# EasyEDA Pro project 遥控关灯发射(物联网+433).eprj

# Schematic Schematic1

## Sheets
1 stm32: Create Date: 2022-12-05; Page Name: stm32; Project Name: 遥控关灯发射(物联网+433); Schematic Name: Schematic1; Update Date: 2022-12-05; Company: 嘉立创EDA; Page Size: A4; Version: V1.0
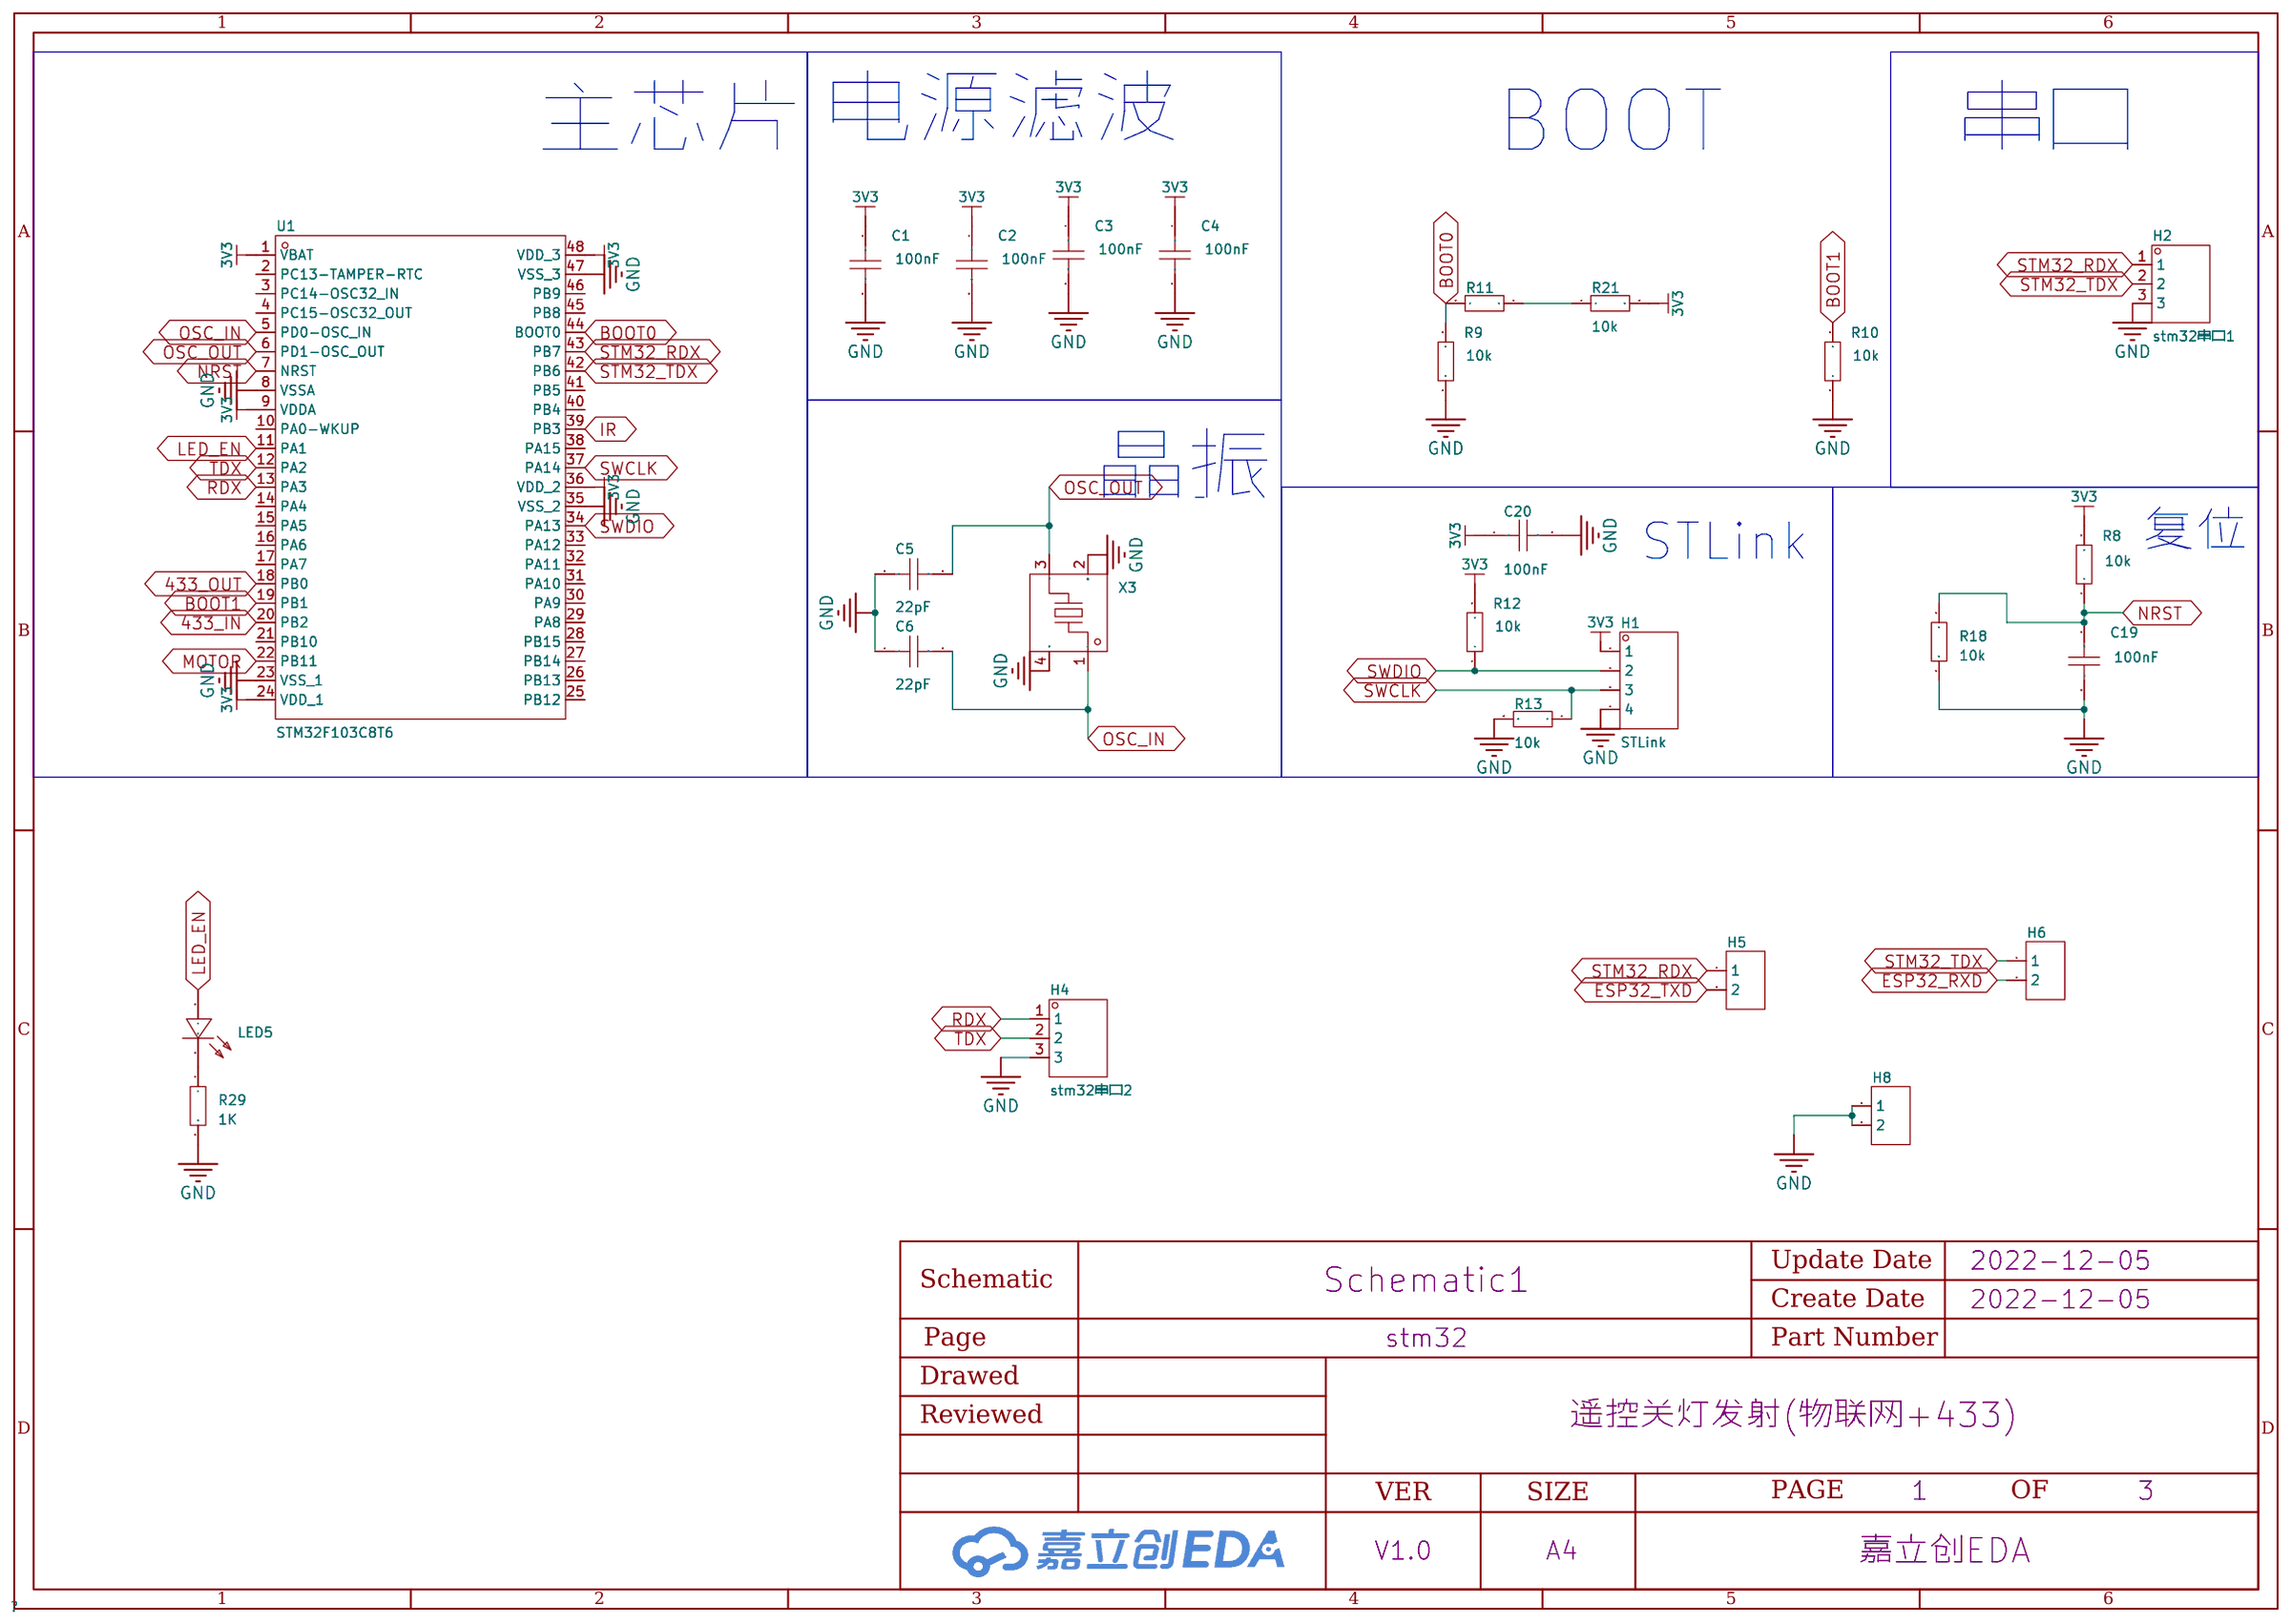
[diagram p0: stm32]
2 esp32: Page Name: esp32; Update Date: 2022-12-10
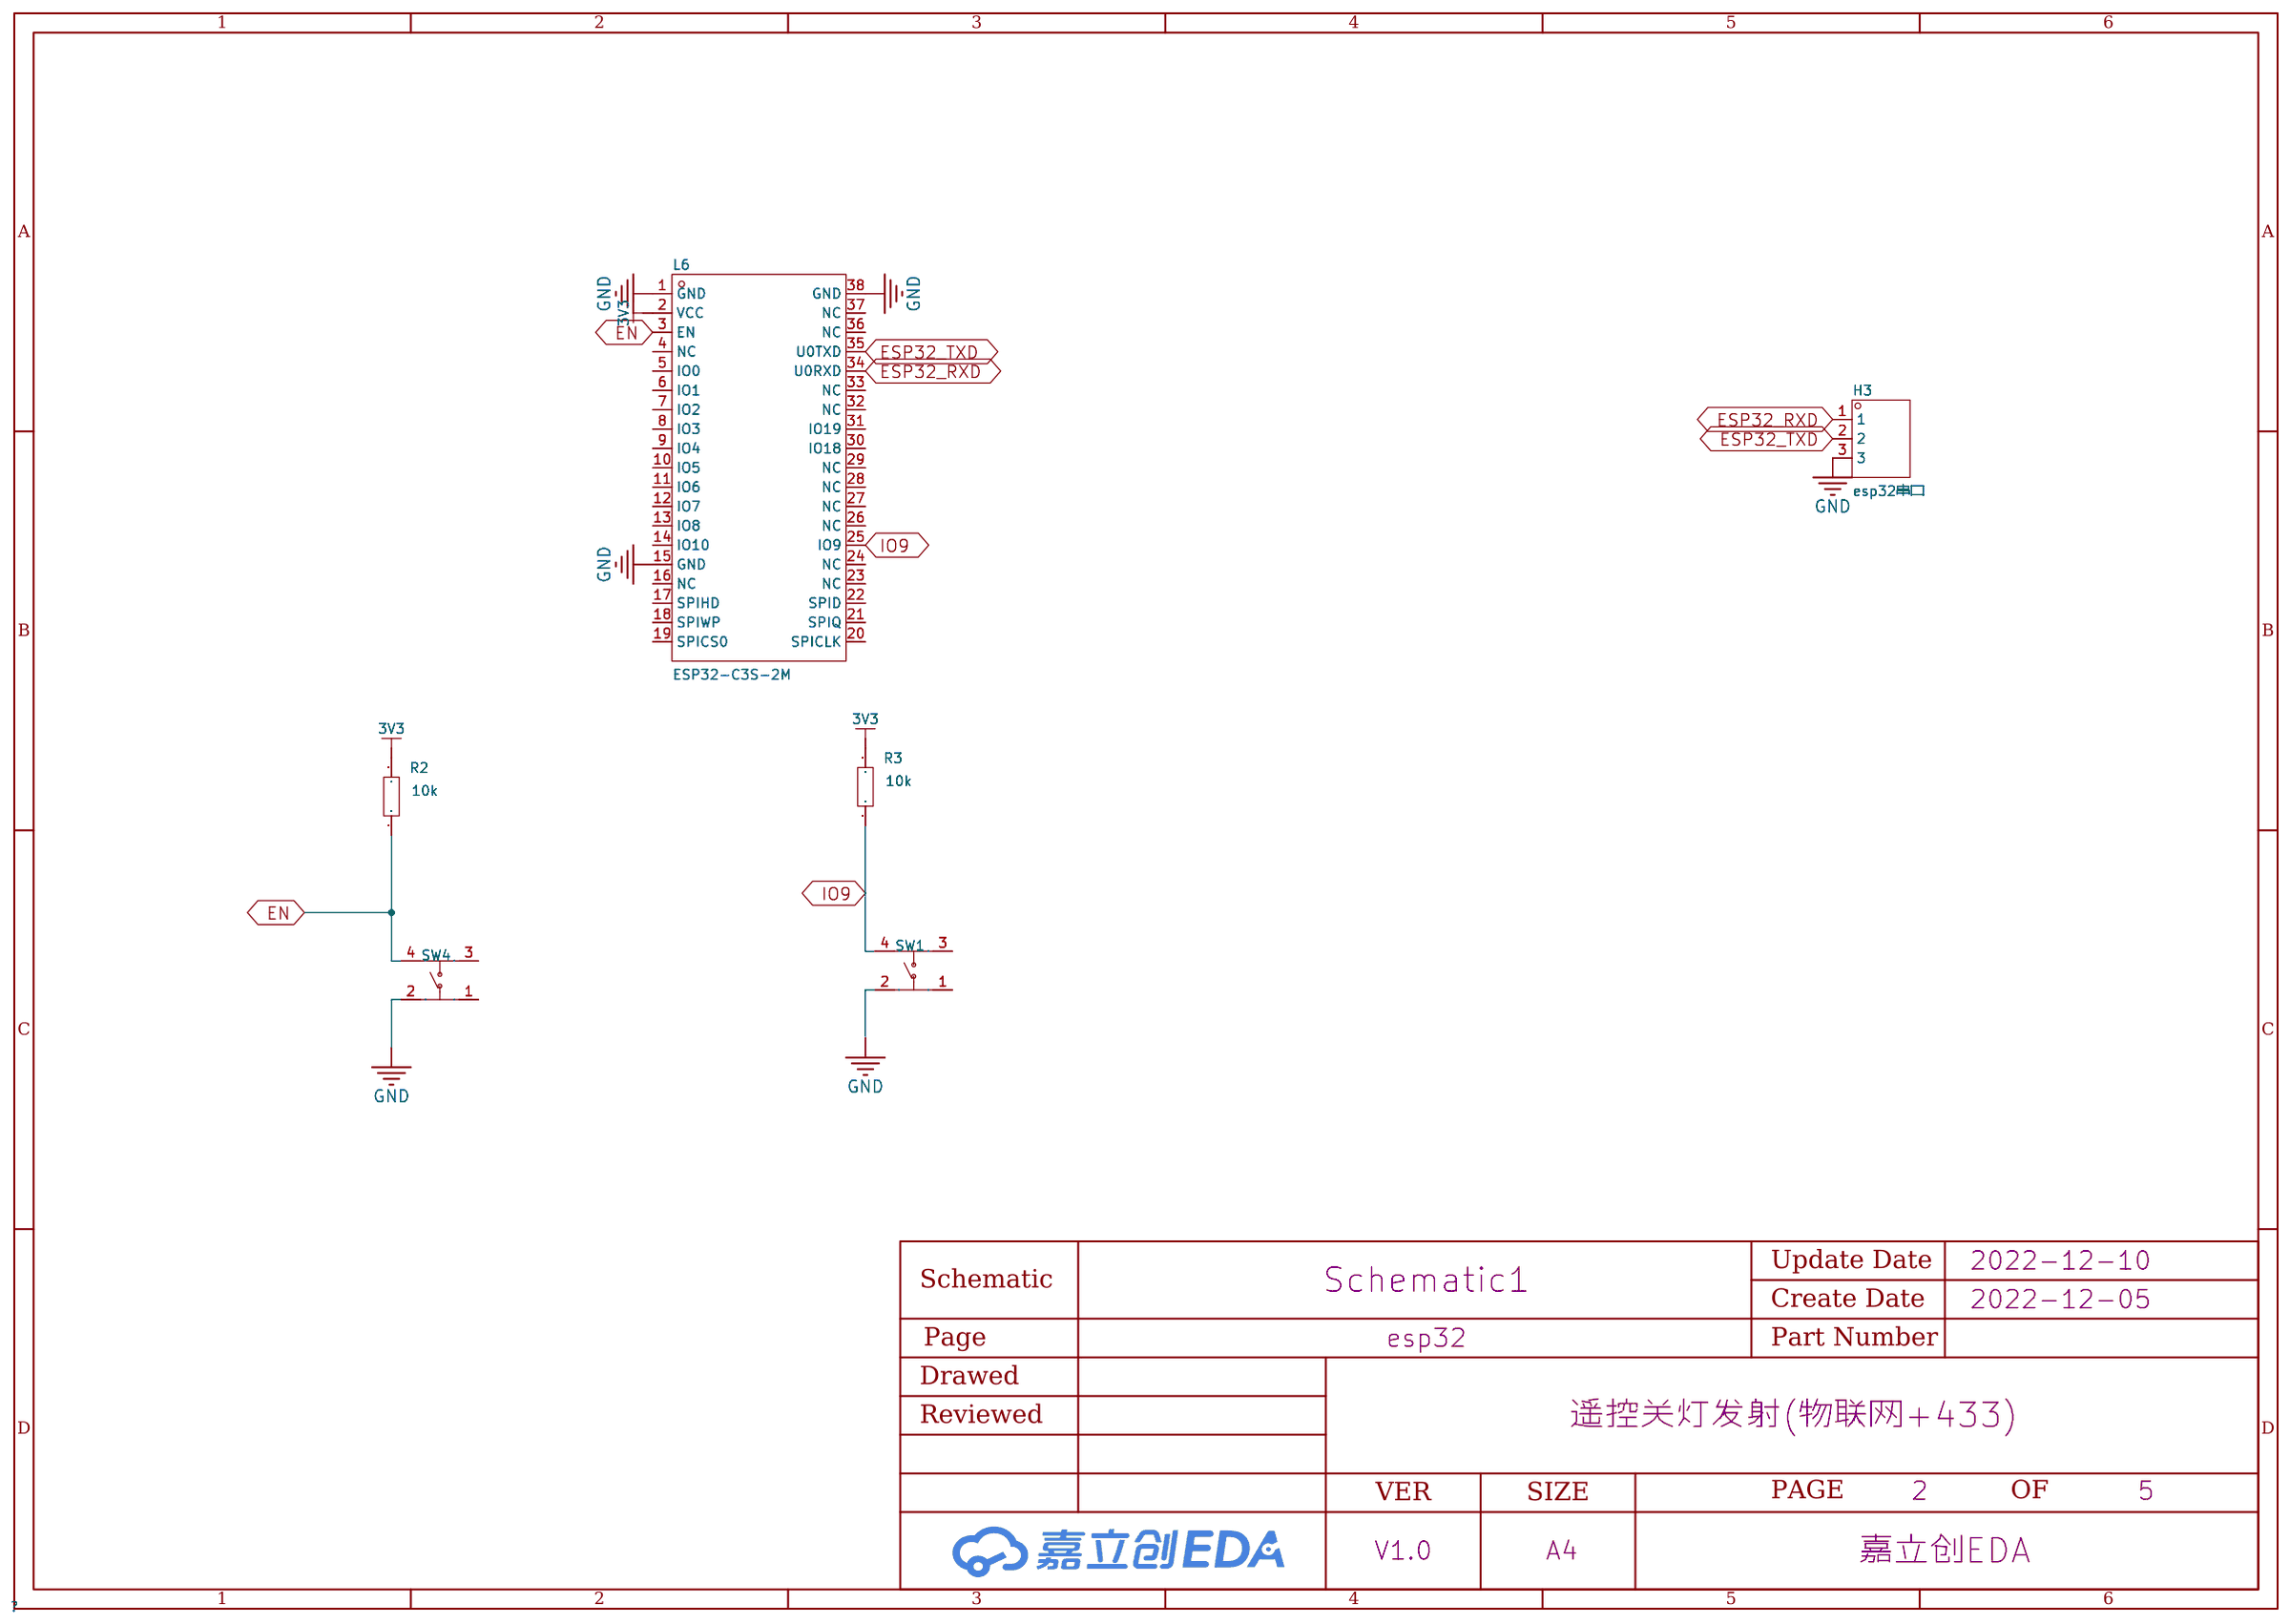
[diagram p1: esp32]
3 433发射: Page Name: 433发射; Update Date: 2022-12-17
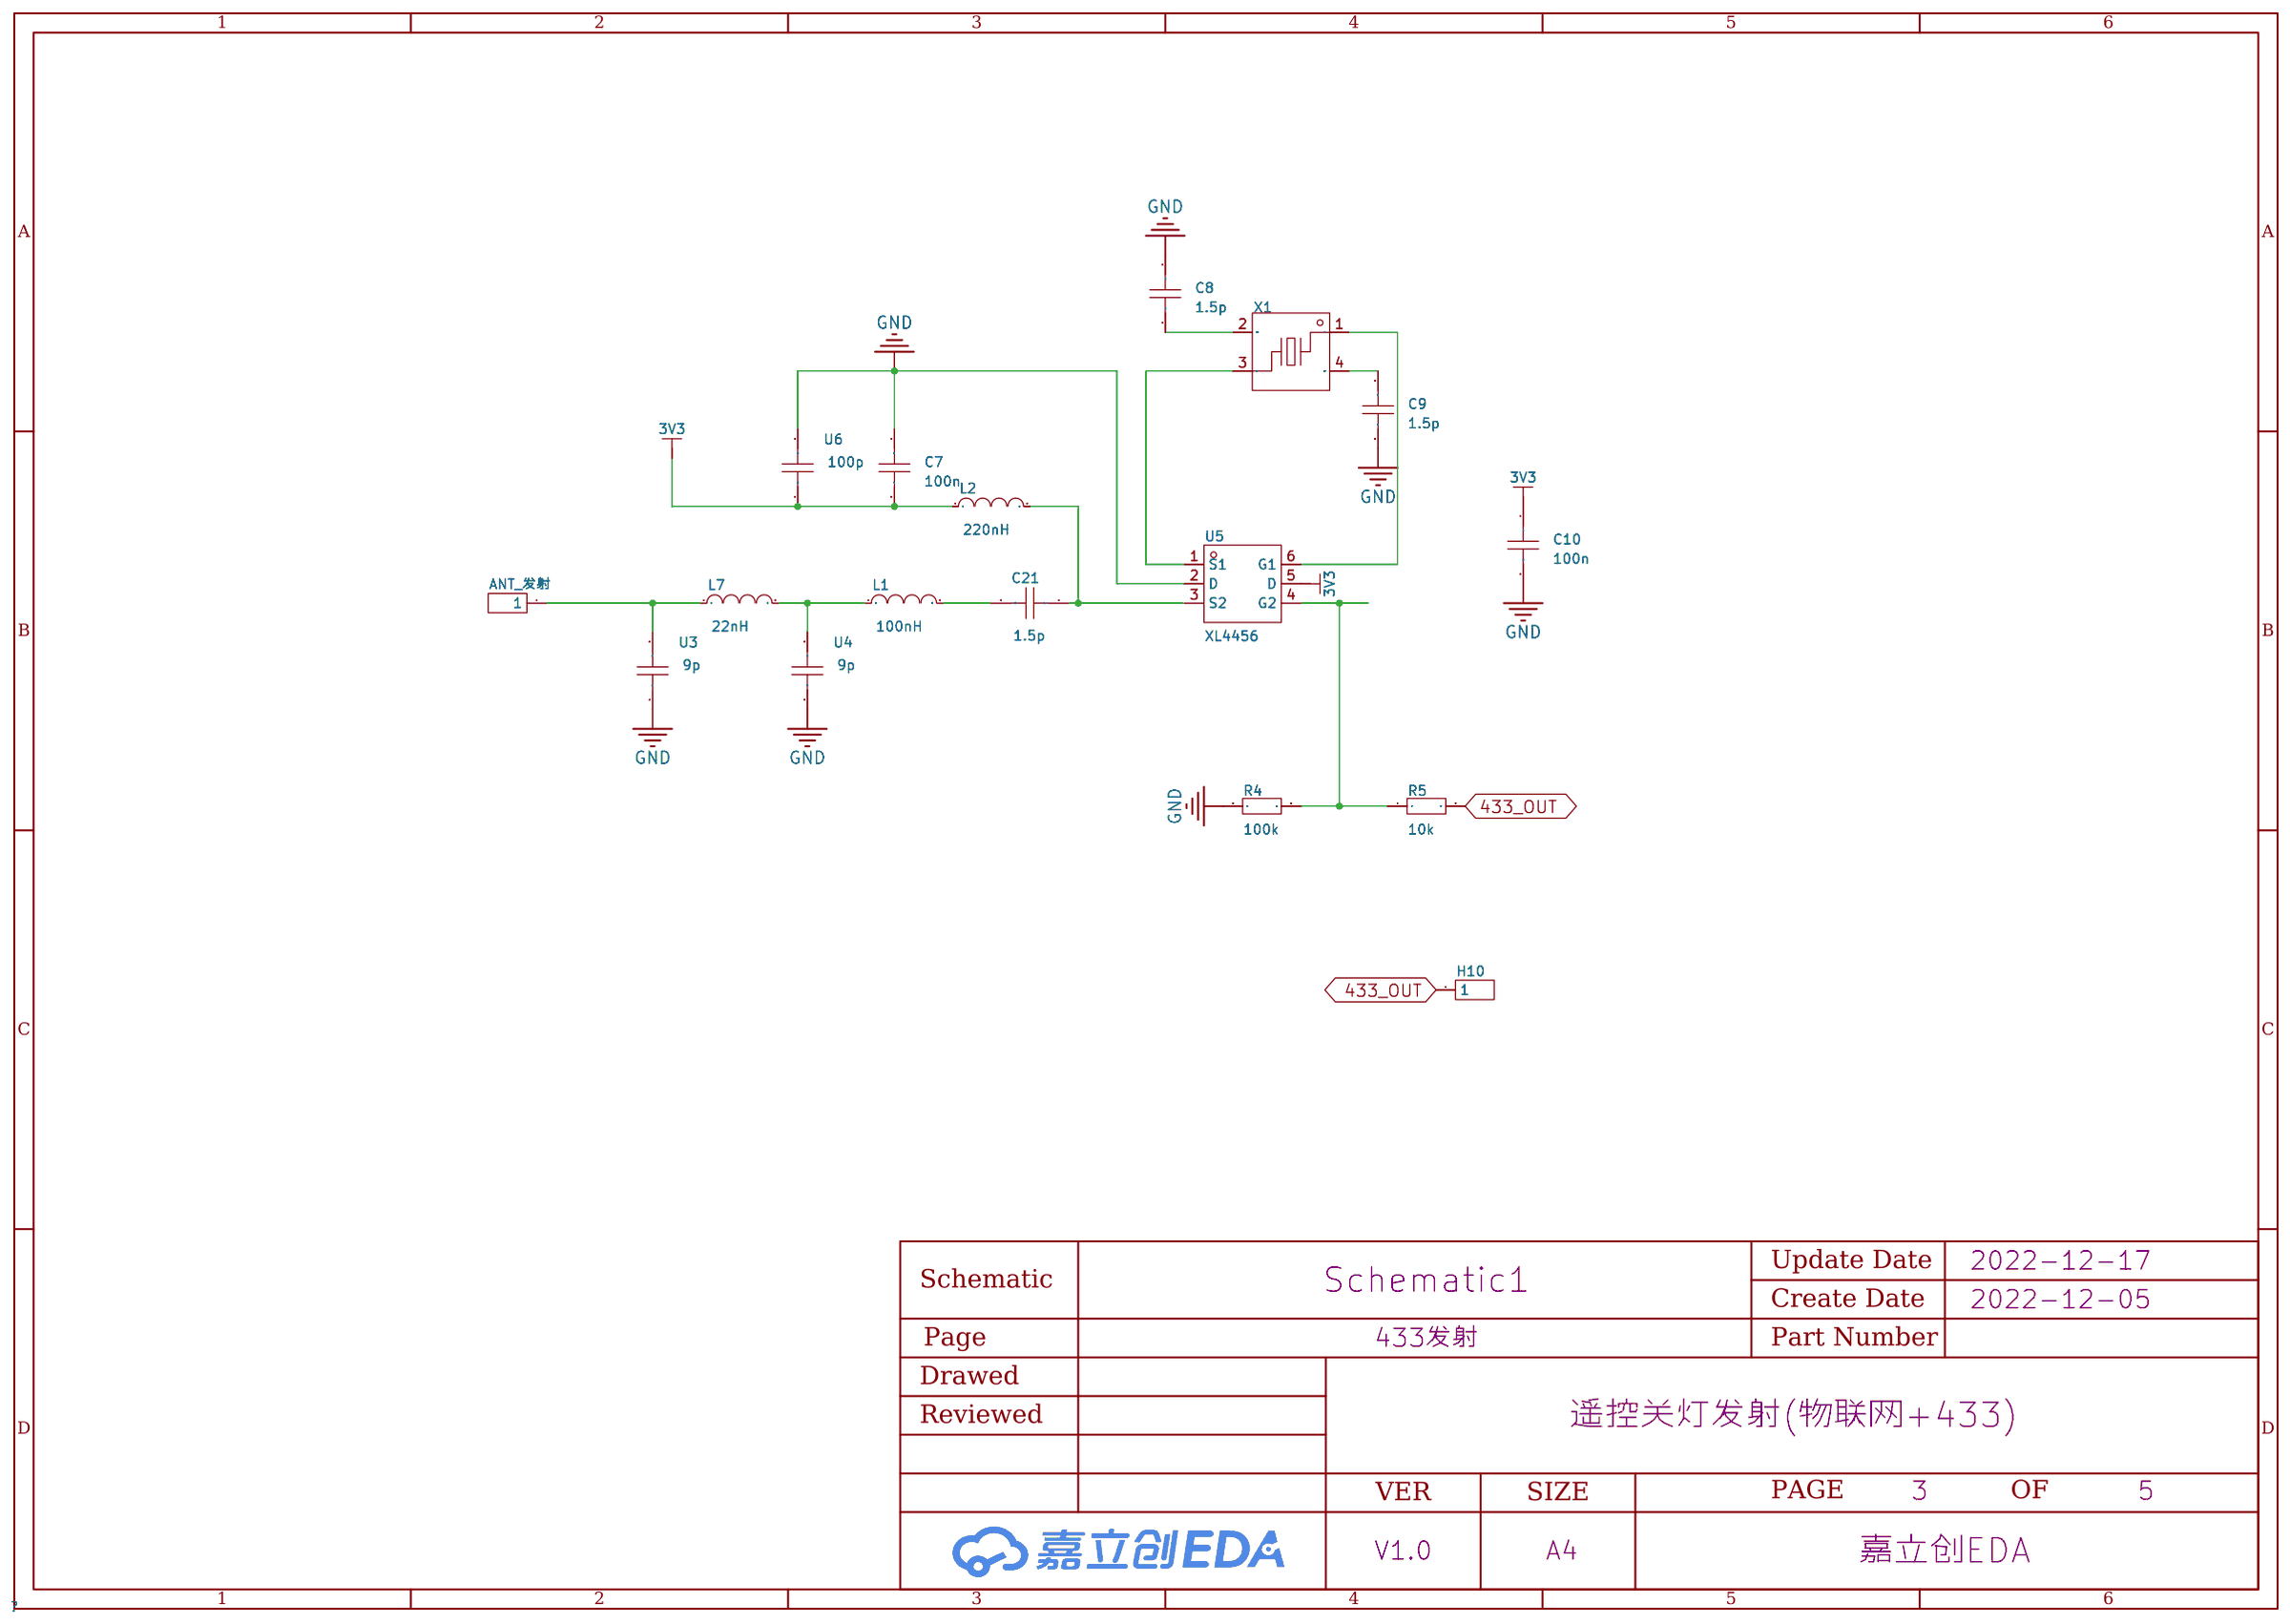
[diagram p2: 433发射]
4 433接收: Page Name: 433接收
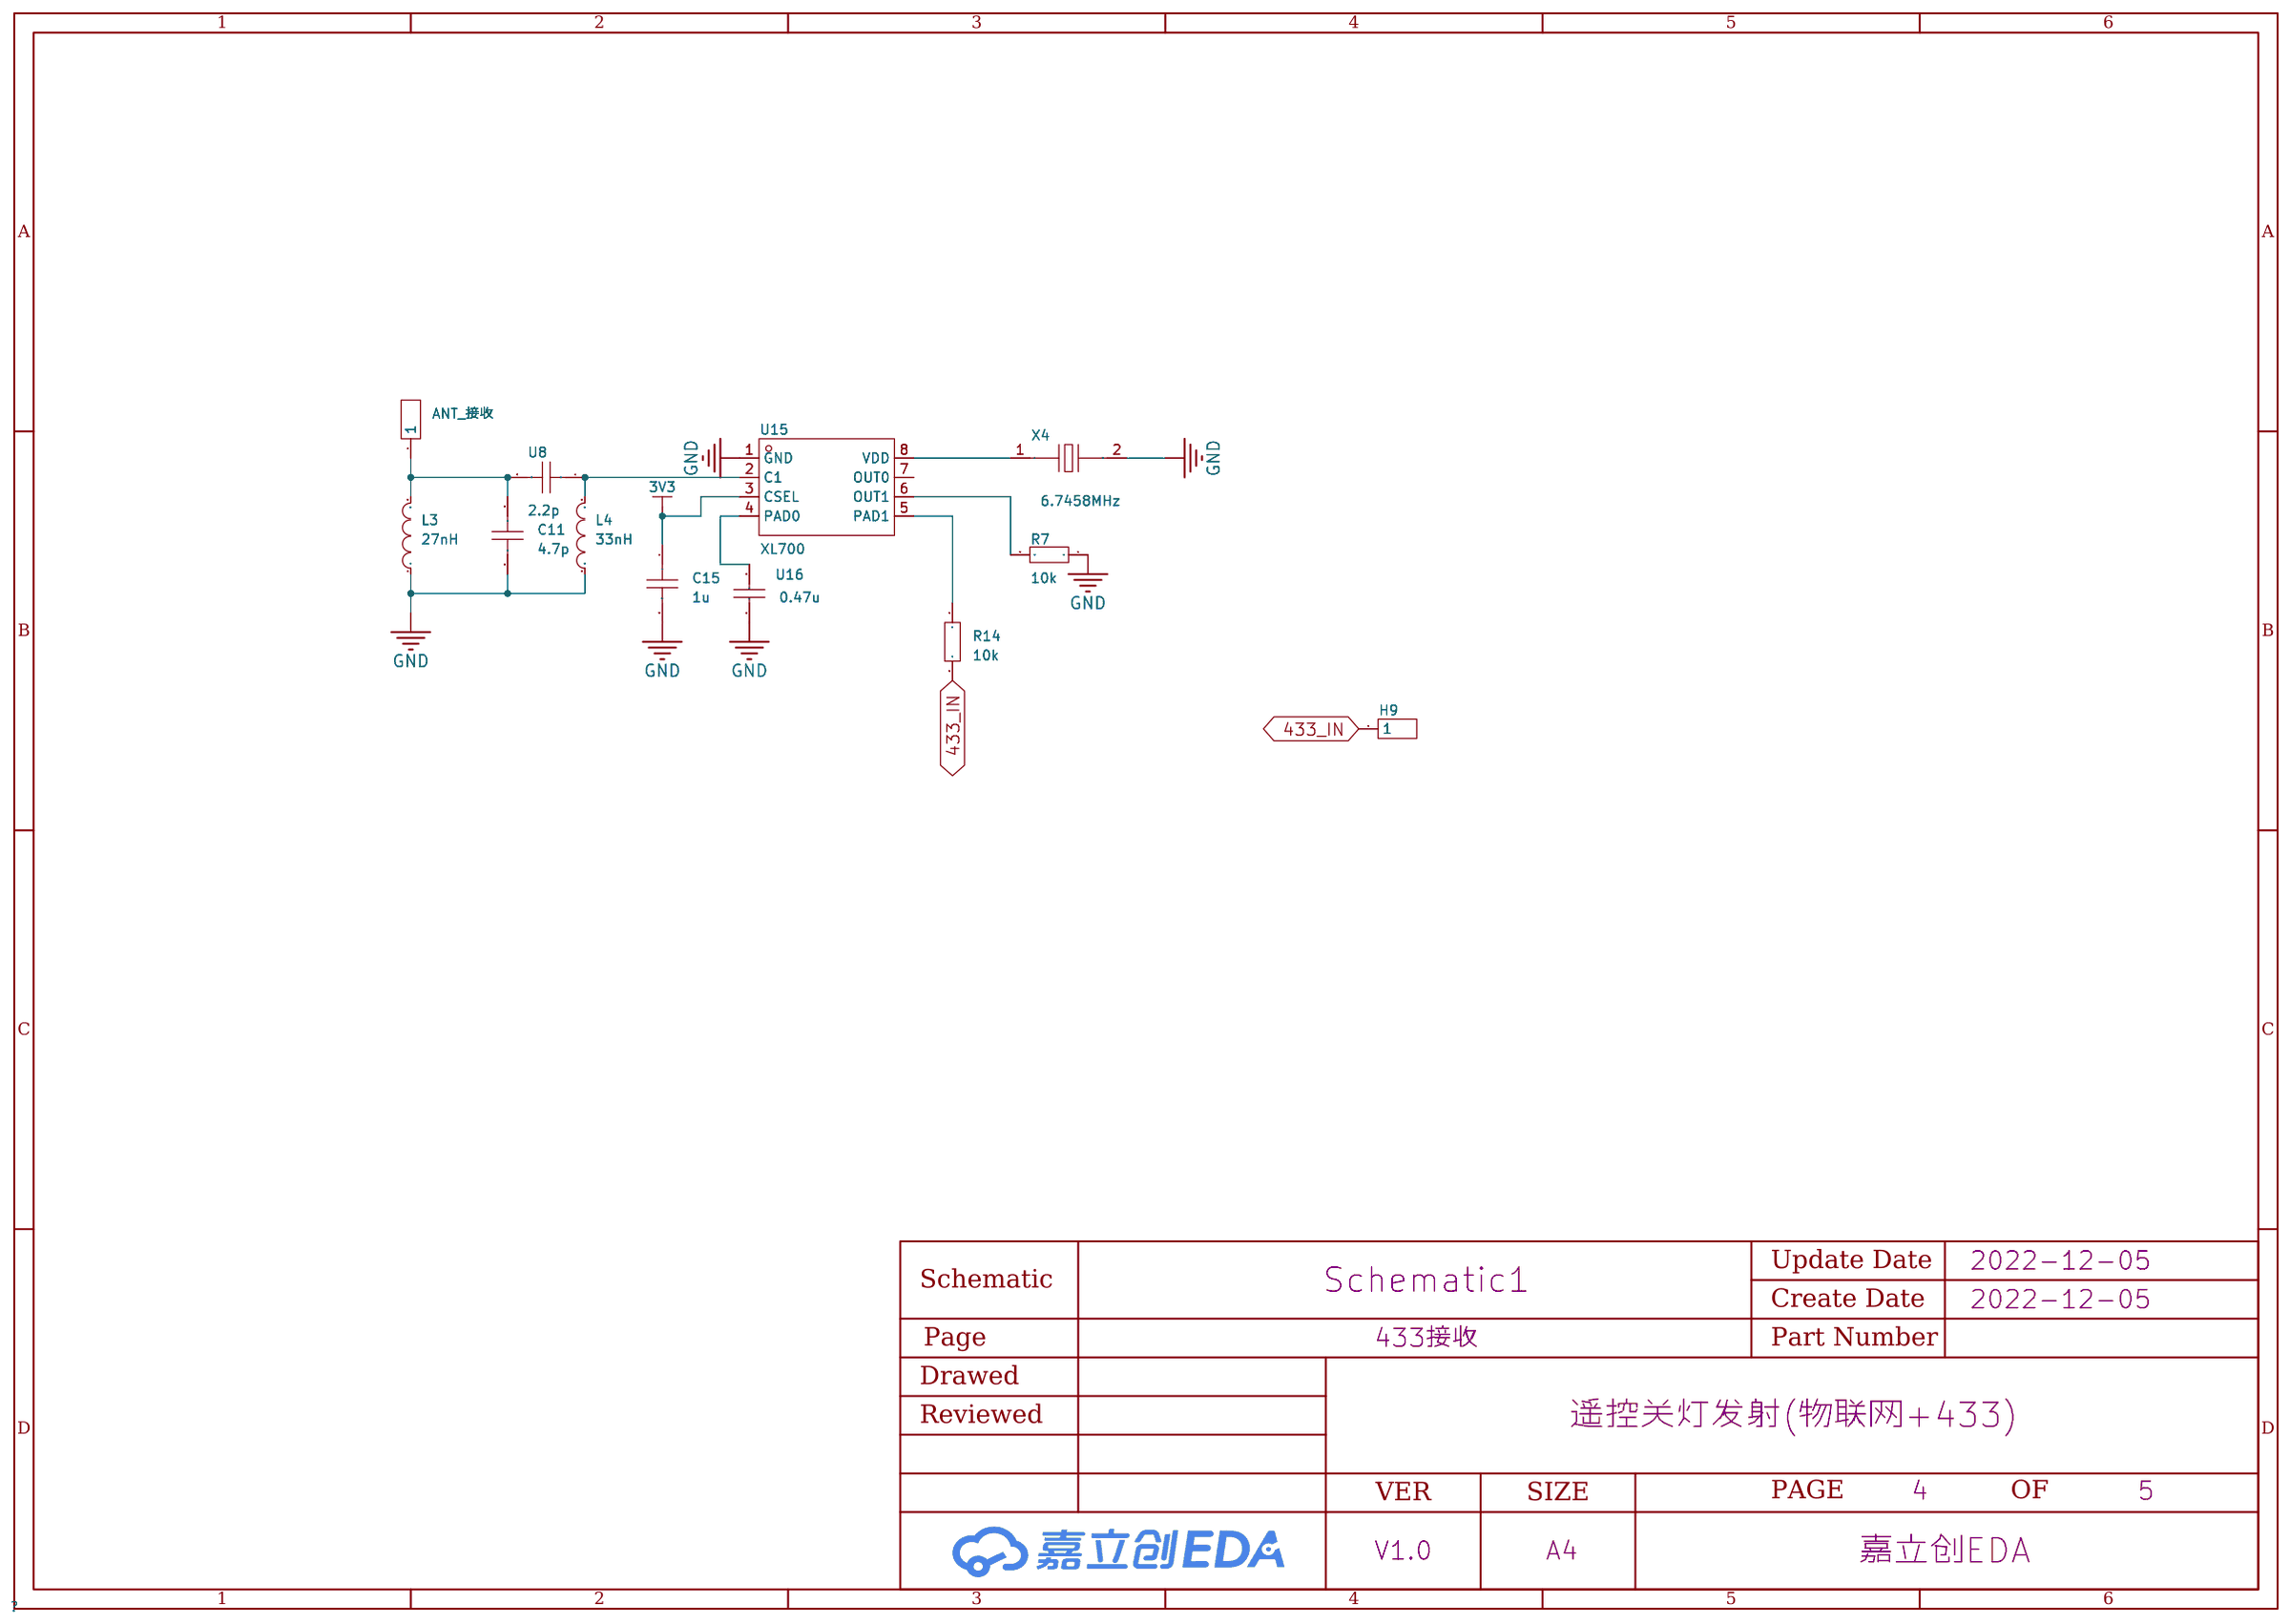
[diagram p3: 433接收]
5 电源: Page Name: 电源
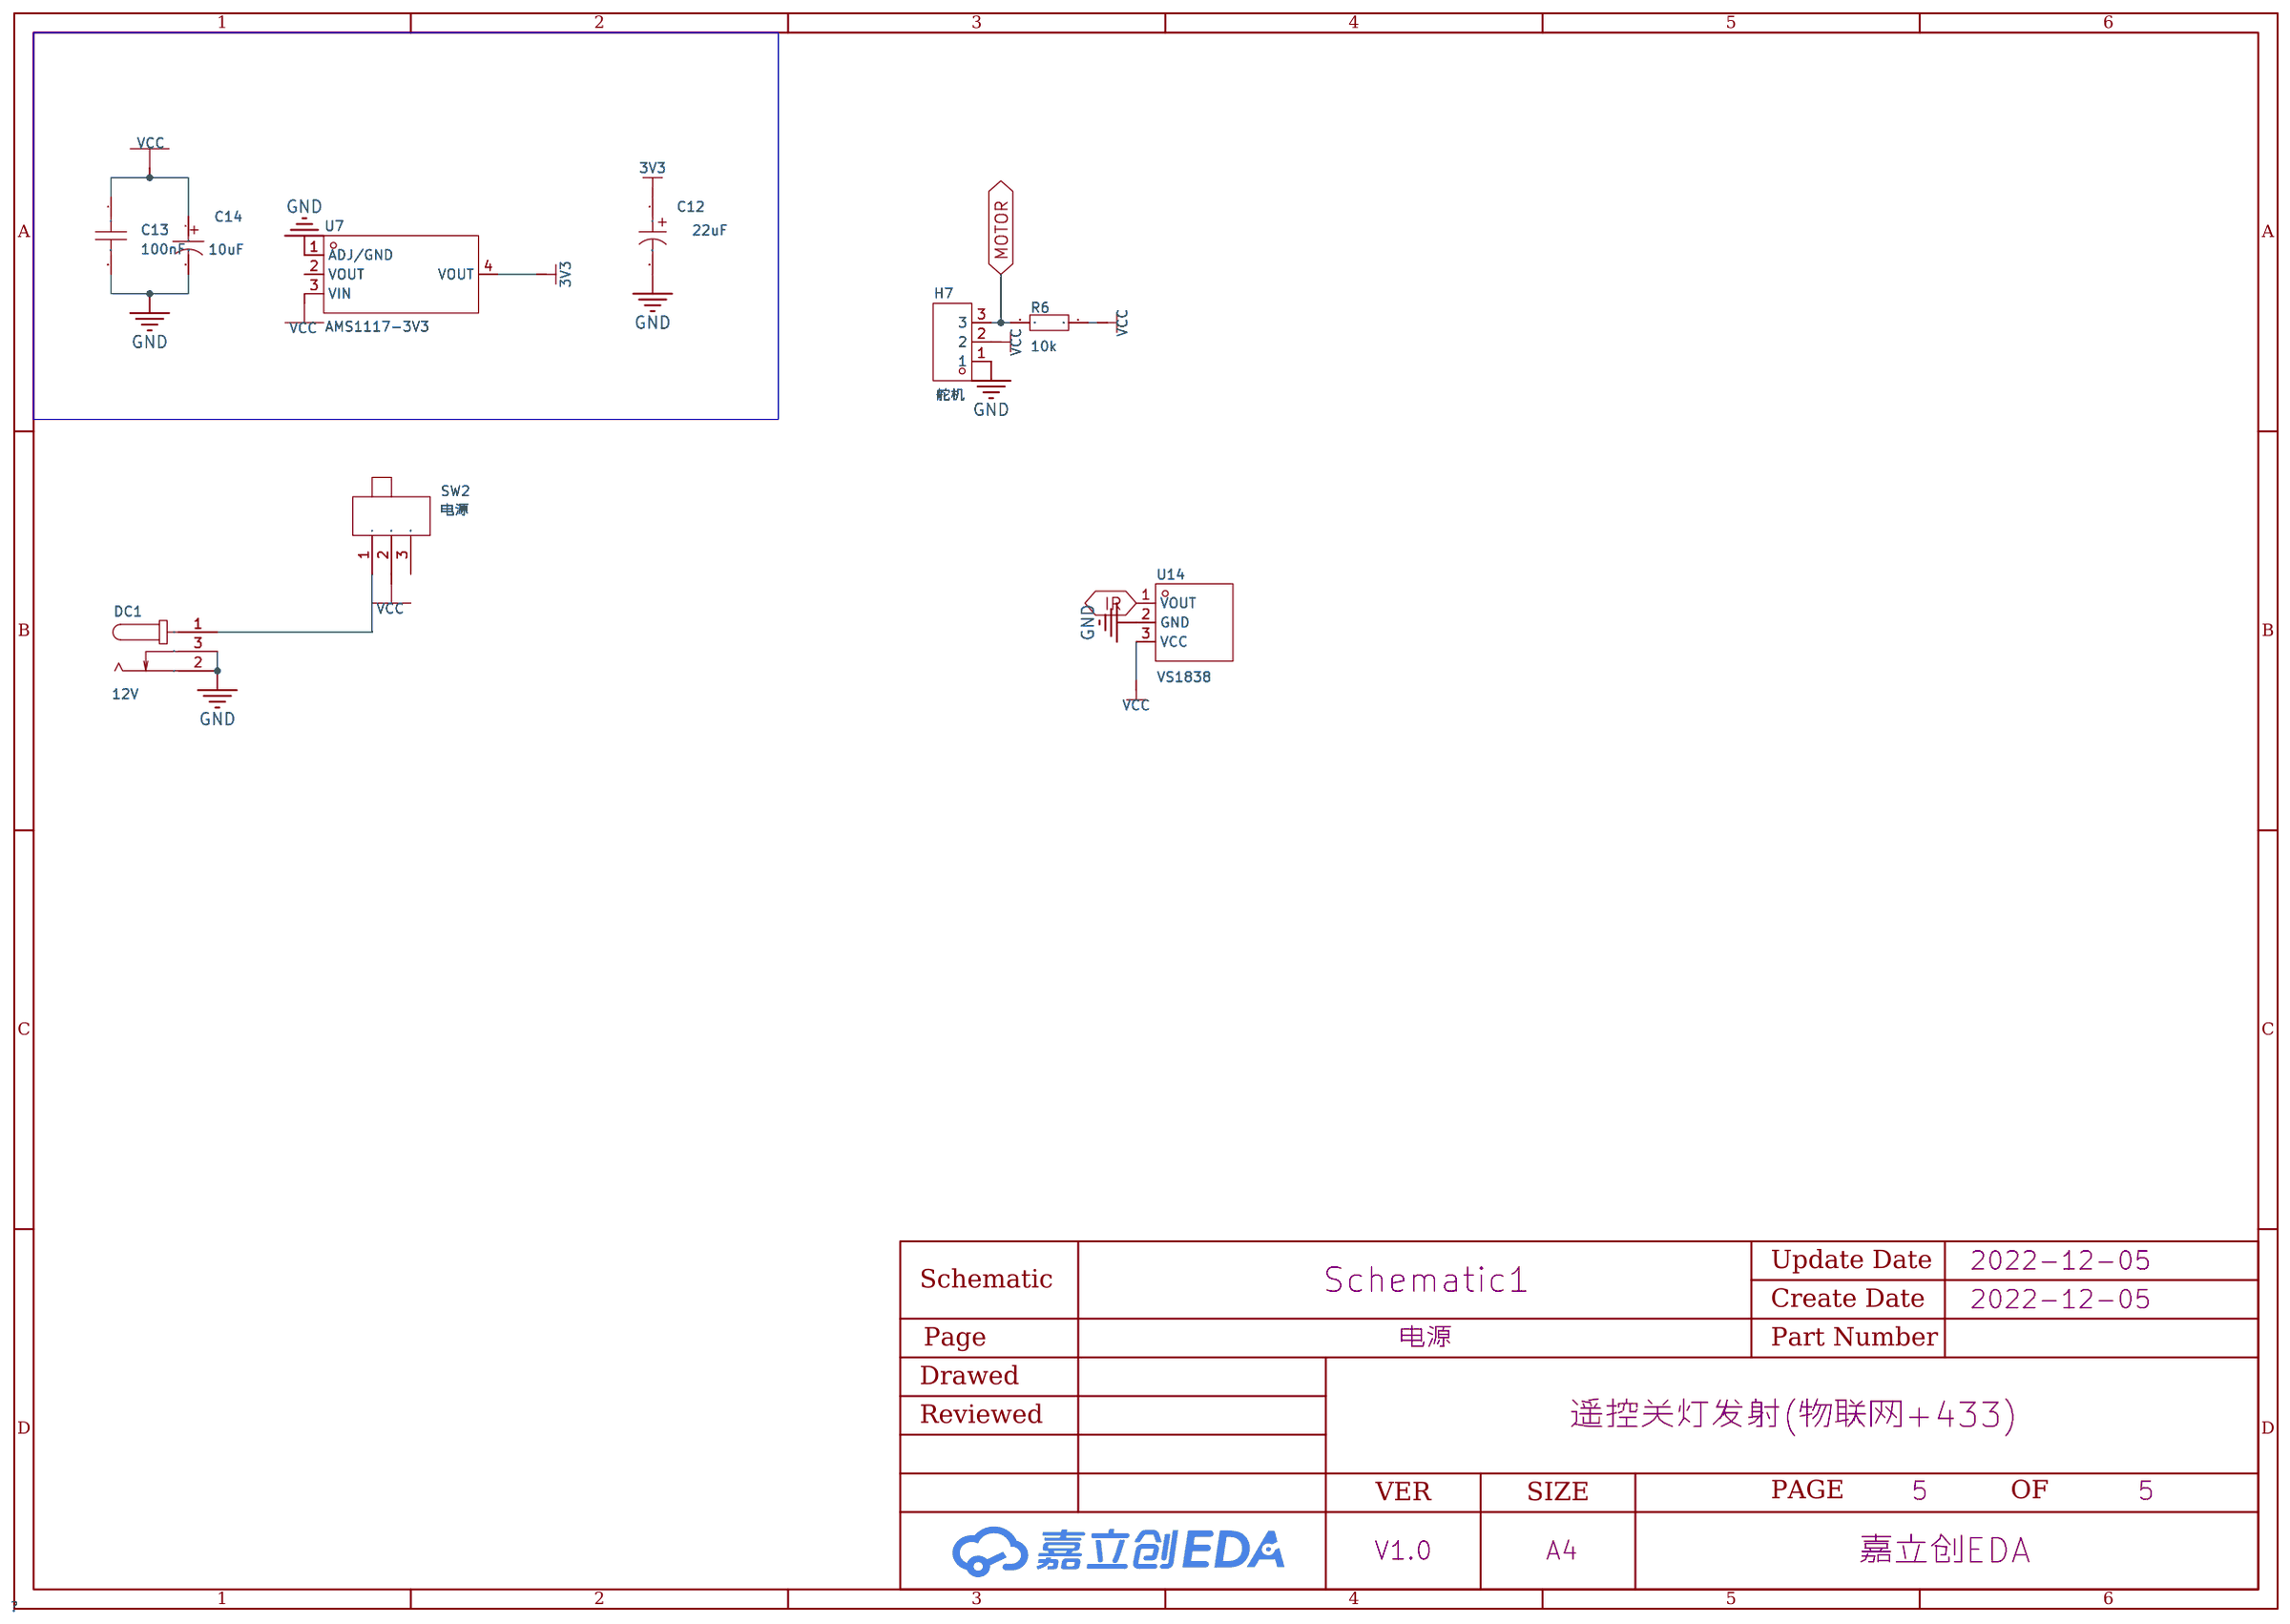
[diagram p4: 电源]

## Parts
sheet 433发射
ANT_发射  -  [HDR-TH_1P-V-M_XKB_X4611WV-01I-C28D40]
C7  100n  [C0805]
C8  1.5p  [C0805]
C9  1.5p  [C0805]
C10  100n  [C0805]
C21  1.5p  [C0805]
H10  -  [HDR-TH_1P-V-M_XKB_X4611WV-01I-C28D40]
L1  100nH  [IND-SMD_L1.7-W1.0-SCW1608C39NJST]
L2  220nH  [IND-SMD_L1.7-W1.0-SCW1608C39NJST]
L7  22nH  [IND-SMD_L1.7-W1.0-SCW1608C39NJST]
R4  100k  [R0805]
R5  10k  [R0805]
U3  9p  [C0603]
U4  9p  [C0603]
U5  XL4456  [SOT-23-6_L2.9-W1.6-P0.95-LS2.9-BL]
U6  100p  [C0603]
X1  NX3225SA-26MHz-STD-CSR-6  [CRYSTAL-SMD_4P-L3.2-W2.5-BL]
sheet 433接收
ANT_接收  -  [HDR-TH_1P-V-M_XKB_X4611WV-01I-C28D40]
C11  4.7p  [C0805]
C15  1u  [C0805]
H9  -  [HDR-TH_1P-V-M_XKB_X4611WV-01I-C28D40]
L3  27nH  [IND-SMD_L1.7-W1.0-SCW1608C39NJST]
L4  33nH  [IND-SMD_L1.7-W1.0-SCW1608C39NJST]
R7  10k  [R0805]
R14  10k  [R0805]
U8  2.2p  [C0603]
U15  XL700  [SOP-8_L4.9-W3.9-P1.27-LS6.0-BL]
U16  0.47u  [C0402]
X4  -  [OSC-SMD_2P-L11.4-W4.7-LS12.3]
sheet esp32
H3  esp32串口  [HDR-TH_3P-P2.54-V-M-1]
L6  ESP32-C3S-2M  [WIFIM-SMD_ESP32-C3S-2M]
R2  10k  [R0805]
R3  10k  [R0805]
SW1  MPU6050  [SW-SMD_4P-L6.0-W6.0-P4.50-LS9.0-2]
SW4  MPU6050  [SW-SMD_4P-L6.0-W6.0-P4.50-LS9.0-2]
sheet stm32
C1  100nF  [C0805]
C2  100nF  [C0805]
C3  100nF  [C0805]
C4  100nF  [C0805]
C5  22pF  [C0805]
C6  22pF  [C0805]
C19  100nF  [C0805]
C20  100nF  [C0805]
H1  STLink  [HDR-TH_4P-P2.54-V-M]
H2  stm32串口1  [HDR-TH_3P-P2.54-V-M-1]
H4  stm32串口2  [HDR-TH_3P-P2.54-V-M-1]
H5  -  [HDR-TH_2P-P2.54-V-F]
H6  -  [HDR-TH_2P-P2.54-V-F]
H8  -  [HDR-TH_2P-P2.54-V-F]
LED5  -  [LED0805-R-RD]
R8  10k  [R0805]
R9  10k  [R0805]
R10  10k  [R0805]
R11  100R  [R0805]
R12  10k  [R0805]
R13  10k  [R0805]
R18  10k  [R0805]
R21  10k  [R0805]
R29  1K  [R0805]
U1  STM32F103C8T6  [LQFP-48_L7.0-W7.0-P0.50-LS9.0-BL]
X3  NX3225SA-26MHz-STD-CSR-6  [CRYSTAL-SMD_4P-L3.2-W2.5-BL]
sheet 电源
C12  22uF  [CAP-TH_BD5.0-P2.00-D0.6-FD]
C13  100nF  [C0805]
C14  10uF  [CAP-TH_BD5.0-P2.00-D0.8-FD]
DC1  12V  [DC-IN-TH_DC005-T20]
H7  舵机  [HDR-TH_3P-P2.54-V-F]
R6  10k  [R0805]
SW2  电源  [SW-TH_MK-12D18-G040]
U7  AMS1117-3V3  [SOT-223-3_L6.7-W3.7-P2.30-LS7.0-BR]
U14  VS1838  [OPTO-TH_3P-L7.0-W5.6-P2.54-L]

## Library data of the parts
ANT_发射 ANT_接收 H9 H10 = HDR-M_2.54_1x1P: Supplier Part: C81276; Supplier Footprint: 插件; JLCPCB Part Class: Extended Part
C1-C11 C13 C15 C19-C21 = 0805: Supplier Part: C9900012713; JLCPCB Part Class: Extended Part; Datasheet: https://atta.szlcsc.comnull; Supplier: LCSC
L1-L4 L7 = L0603: Supplier Part: C9900016892; Supplier Footprint: 16nH/±2%/0603; JLCPCB Part Class: Extended Part; Datasheet: https://atta.szlcsc.comnull; Supplier: LCSC
R2-R14 R18 R21 R29 = 0805: Supplier Part: C9900012715; JLCPCB Part Class: Extended Part; Datasheet: https://atta.szlcsc.comnull; Supplier: LCSC
U3 U4 U6 U8 = 104P: Supplier Part: C9900009971; JLCPCB Part Class: Extended Part; Datasheet: https://atta.szlcsc.comnull; Supplier: LCSC
U5 = JMTM8205A: LCSC Part Name: 贴片MOS管; Supplier Part: C5173657; Manufacturer: JJW(捷捷微); Supplier Footprint: SOT23-6L; Datasheet: https://atta.szlcsc.com/upload/public/pdf/source/20220916/99A365091B307E9B4FA2C8643662B7D1.pdf; Supplier: LCSC
X1 X3 = NX3225SA-26MHz-STD-CSR-6: LCSC Part Name: NX3225SA 26MHz 8pF ±15ppm ?40 to +85 °C; Supplier Part: C880099; Manufacturer: NDK; Supplier Footprint: 3225; JLCPCB Part Class: Extended Part; Datasheet: https://atta.szlcsc.com/upload/public/pdf/source/20171201/C156252_15121213466341157580.pdf; Supplier: LCSC
U15 = XW02E SOP8: 触摸芯片  XW02E SOP8 两通道触摸感应芯片 ,低功耗 强抗干扰 ；长按时间可达到30分钟； 可以抗ESD8000V 动态cs10v EFT4000V的测试 ；容易通过 EMC 测试; 唤醒时间0.2s，广泛应用于脱毛仪、铲皮刀等美容产品，筋膜枪，雾化器，加湿器，直饮机，水平仪 、咖啡机、 速热机等各类电源干扰大的产品-（不误动作）; LCSC Part Name: 触摸芯片; Supplier Part: C5156897; Manufacturer: Sam&wing(芯网); Supplier Footprint: SOP-8; Datasheet: https://atta.szlcsc.com/upload/public/pdf/source/20221018/6033144A9FF62F478D7EFEAD640D9693.pdf; Supplier: LCSC
U16 = 16p: Supplier Part: C9900003759; JLCPCB Part Class: Extended Part; Datasheet: https://atta.szlcsc.comnull; Supplier: LCSC
X4 = 49SMD-4MHZ-15PF-20PPM: 晶振类型:-;频率:-;负载电容:-;工作温度:-;; Supplier Part: C337676; Manufacturer: TKD(泰晶); Supplier Footprint: HC-49S-SMD-2P; JLCPCB Part Class: Extended Part; Datasheet: https://atta.szlcsc.com/upload/public/pdf/source/20190802/C337676_755A2B85AE73FBC05217DA61C6B0E5FE.pdf; Supplier: LCSC
H2-H4 = 77311-102-03LF: 间距:2.54mm;总PIN位数:3;排数:1;插针结构:-;行距:-;安装类型:直插;圆针/方针:-;额定电流:-;额定电压:-;配合针长度:-;塑高:-;触头材质:磷青铜;触头镀层:-;颜色:黑色;; LCSC Part Name: 2.54mm; Supplier Part: C180248; Manufacturer: Amphenol; Supplier Footprint: 插件,P=2.54mm; JLCPCB Part Class: Extended Part; Datasheet: https://atta.szlcsc.com/upload/public/pdf/source/20180329/C180248_62E264527695F7ED58561BB828D45E42.pdf; Supplier: LCSC; Pitch: 2.54mm; Number of Pins: 3; Number of Rows: 1; Mounting Type: 直插; Contact Material: 磷青铜; Color: 黑色
L6 = ESP32-C3S-2M: Supplier Part: C2830866; Manufacturer: Ai-Thinker(安信可); Supplier Footprint: SMD,25.5x18.0x3.1mm; JLCPCB Part Class: Extended Part; Datasheet: https://atta.szlcsc.com/upload/public/pdf/source/20210507/C2830866_AFB4208B43AF060B6FB5B82D9E5A1C0B.pdf; Supplier: LCSC
SW1 SW4 = KH-6X6X5H-STM: 触点电流:50mA;额定电压(DC):12V;电路结构:单刀单掷;安装方式:立贴;按钮形状:圆形按钮;按钮/盖帽颜色:黑色;机械寿命:80000;引脚样式:鸥翼型;开关长度:6mm;开关宽度:6mm;开关高度:5mm;带支架:否;; Supplier Part: C2837531; Manufacturer: kinghelm(金航标); Supplier Footprint: SMD; JLCPCB Part Class: Extended Part; Datasheet: https://atta.szlcsc.com/upload/public/pdf/source/20210608/C2837531_45E87AB996CE723B09405FF2EA209C4C.pdf; Supplier: LCSC; Contact Current: 50mA; Voltage Rating (DC): 12V; Circuit: 单刀单掷; Mounting Style: 立贴; Actuator Style: 圆形按钮; Actuator/Cap Color: 黑色; Mechanical Life: 80000; Pin Style: 鸥翼型; Switch Length: 6mm; Switch Width: 6mm; Switch Height: 5mm; Strike Gundam: 否
H1 = B-2100S04P-A110: 间距:2.54mm;总PIN位数:4;排数:1;插针结构:1x4P;行距:-;安装类型:直插;圆针/方针:-;额定电流:-;额定电压:-;配合针长度:6mm;塑高:2.54mm;端接针长度:3mm;触头材质:黄铜;触头镀层:-;工作温度范围:-40~+105;颜色:黑色;; LCSC Part Name: 2.54mm 1x4P; Supplier Part: C124378; Manufacturer: Ckmtw(灿科盟); Supplier Footprint: 插件,P=2.54mm; JLCPCB Part Class: Extended Part; Datasheet: https://atta.szlcsc.com/upload/public/pdf/source/20170821/C124378_1503303307508901532.pdf; Supplier: LCSC; Pitch: 2.54mm; Number of Pins: 4; Number of Rows: 1; Pin Structure: 1x4P; Mounting Type: 直插; Length of Mating Pin: 6mm; Insulation Height: 2.54mm; Length of End Connection Pin: 3mm; Contact Material: 黄铜; Operating Temperature Range: -40~+105; Color: 黑色
H5 H6 H8 = HDR-F_2.54_1x2P: Supplier Part: C49661; Supplier Footprint: 插件
LED5 = NCD0805G1: 发光颜色:翠绿;; LCSC Part Name: 翠绿; Supplier Part: C84260; Manufacturer: 国星光电; Supplier Footprint: 0805; JLCPCB Part Class: Extended Part; Datasheet: https://atta.szlcsc.com/upload/public/pdf/source/20200820/C84260_AFC7BF57C6FBA034D182BB8D10A67EFE.pdf; Supplier: LCSC; Emitted Color: 翠绿
U1 = STM32F103C8T6: CPU位数:32-Bit;ROM类型:FLASH;CPU内核:ARM® Cortex®-M3;主频（MAX):72MHz;工作电压:2V ~ 3.6V;; LCSC Part Name: STM32F103C8T6 MSL=3; Supplier Part: C8734; Manufacturer: ST(意法半导体); Supplier Footprint: LQFP-48_7x7x05P; JLCPCB Part Class: Basic Part; Datasheet: https://atta.szlcsc.com/upload/public/pdf/source/20140724/1457707174202.pdf; Supplier: LCSC; Core Size: 32-Bit; Program Memory Type: FLASH; Core Processor: ARM® Cortex®-M3; Speed: 72MHz; Voltage - Supply (Vcc/Vdd): 2V ~ 3.6V; Program Memory Size: 64KB; RAM Size: 20KB; Number of I/O: 37; A/D: 10x12bit; D/A: 0; PWM: 13; LCD: 0; UART/USART: 3 USART; SPI: 2; I2C（SMBUS/PMBUS）: 2; USB Device: 1; CAN: 1; Ethernet: 0
C12 = LW220M0500511PV2-D5: LCSC Part Name: 22uF 50V; Supplier Part: C2847230; Manufacturer: UNITED(怡德); Supplier Footprint: 径向引线,5x11mm; JLCPCB Part Class: Extended Part; Datasheet: https://atta.szlcsc.com/upload/public/pdf/source/20210723/C2847230_6E41DE0F8E72341694F7D9843C90A4AD.pdf; Supplier: LCSC
C14 = KM106M025D11RR0VH2FP0: 脚间距:2mm;额定电压:25V;纹波电流:38mA 120Hz;等效串联电阻:-;精度:±20%;电容体直径:5mm;工作温度:-;电容体长度:11mm;容值:10uF;工作寿命:1000hrs 105;; LCSC Part Name: 10uF 25V; Supplier Part: C43347; Manufacturer: CX(承兴); Supplier Footprint: 径向引线,5x11mm; JLCPCB Part Class: Extended Part; Datasheet: https://atta.szlcsc.com/upload/public/pdf/source/20151029/1457707524171.pdf; Supplier: LCSC; Lead Spacing: 2mm; Rated Voltage: 25V; Ripple Current: 38mA 120Hz; Tolerance: ±20%; φD: 5mm; L: 11mm; Lifetime @ Temp: 1000hrs 105
DC1 = DC005-T20: 连接器类型:DC电源插座;安装方式:弯插;触点内径:-;触点外径:6.3mm;额定电流:3A;额定电压:30V;工作温度范围:-10~+60;; LCSC Part Name: 外径:6.3mm B级 全铜; Supplier Part: C111567; Manufacturer: SOFNG(硕方); Supplier Footprint: 插件; JLCPCB Part Class: Extended Part; Datasheet: https://atta.szlcsc.com/upload/public/pdf/source/20170519/1495157966733.pdf; Supplier: LCSC; Connector Type: DC电源插座; Mounting Style: 弯插; Outside Contact Diameter: 6.3mm; Current Rating (Max): 3A; Voltage Rating (Max): 30V; Operating Temperature Range: -10~+60
H7 = HDR-F_2.54_1x3P: Supplier Part: C541850; Supplier Footprint: 插件
SW2 = MK-12D18-G020: LCSC Part Name: 边三脚微型拨动开关G4; Supplier Part: C3019727; Manufacturer: G-Switch(品赞); Supplier Footprint: 插件; JLCPCB Part Class: Extended Part; Datasheet: https://atta.szlcsc.com/upload/public/pdf/source/20201201/C963202_825FB742C5BA766BED52E1DDA96DE5A3.pdf; Supplier: LCSC
U7 = AMS1117-5.0: 静态电流(Iq):-;输出类型:固定;最大输入电压:18V;输出电压(可调):-;压降(max):1.5V @ 1A;输出电压(固定):5V;; Supplier Part: C473812; Manufacturer: Slkor(萨科微); Supplier Footprint: SOT-223; JLCPCB Part Class: Extended Part; Datasheet: https://atta.szlcsc.com/upload/public/pdf/source/20201231/C426566_7F22DB93439D00F3FA27143E4F28C6AA.pdf; Supplier: LCSC; Output Configuration: 正; Current - Supply (Max): 5mA; Output Current (Max): 1.4A; Output Type: 固定; Number of Output Channels: 1; Voltage - Input (Max): 18V; Operating Temperature: -40~85; Voltage Dropout (Max): 1.5V @ 1A; Voltage - Output (Fixed): 5V
U14 = DY-IRM-AC01-AN: LCSC Part Name: 38K解码接收头; Supplier Part: C2759912; Manufacturer: TONYU(东裕); Supplier Footprint: 插件; JLCPCB Part Class: Extended Part; Datasheet: https://atta.szlcsc.com/upload/public/pdf/source/20210319/C2759912_32410E2E7FB9BD2506BF27C3C0537725.pdf; Supplier: LCSC

## Nets
3V3: C1.1 C2.1 C3.1 C4.1 C7.2 C10.1 C12.1 C15.1 C20.1 H1.1 L2.1 L6.2(VCC) R2.2 R3.2 R8.2 R12.2 R21.2 U1.1(VBAT) U1.9(VDDA) U1.24(VDD_1) U1.36(VDD_2) U1.48(VDD_3) U5.5(D) U6.1 U7.4(VOUT) U15.3(CSEL)
GND: C1.2 C2.2 C3.2 C4.2 C5.1 C6.1 C7.1 C8.1 C9.2 C10.2 C11.2 C12.2 C13.2 C14.2 C15.2 C19.2 C20.2 DC1.2 DC1.3 H1.4 H2.3 H3.3 H4.3 H7.1 H8.1 H8.2 L3.1 L4.1 L6.1(GND) L6.15(GND) L6.38(GND) R4.1 R7.1 R9.1 R10.1 R13.2 R18.2 R29.2 SW1.2 SW4.2 U1.8(VSSA) U1.23(VSS_1) U1.35(VSS_2) U1.47(VSS_3) U3.1 U4.1 U5.2(D) U6.2 U7.1(ADJ/GND) U14.2(GND) U15.1(GND) U16.1 X3.2(GND) X3.4(GND) X4.2
VCC: C13.1 C14.1 H7.2 R6.1 SW2.2 U7.3(VIN) U14.3(VCC)
433_IN: H9.1 R14.2 U1.20(PB2)
433_OUT: H10.1 R5.2 U1.18(PB0)
BOOT0: R9.2 R11.2 U1.44(BOOT0)
BOOT1: R10.2 U1.19(PB1)
EN: L6.3(EN) R2.1 SW4.4
ESP32_RXD: H3.1 H6.2 L6.34(U0RXD)
ESP32_TXD: H3.2 H5.2 L6.35(U0TXD)
IO9: L6.25(IO9) R3.1 SW1.4
IR: U1.39(PB3) U14.1(VOUT)
LED_EN: LED5.1(A) U1.11(PA1)
MOTOR: H7.3 R6.2 U1.22(PB11)
NRST: C19.1 R8.1 R18.1 U1.7(NRST)
OSC_IN: C6.2 U1.5(PD0-OSC_IN) X3.1
OSC_OUT: C5.2 U1.6(PD1-OSC_OUT) X3.3
RDX: H4.1 U1.13(PA3)
STM32_RDX: H2.1 H5.1 U1.43(PB7)
STM32_TDX: H2.2 H6.1 U1.42(PB6)
SWCLK: H1.3 R13.1 U1.37(PA14)
SWDIO: H1.2 R12.1 U1.34(PA13)
TDX: H4.2 U1.12(PA2)
$1N6598: LED5.2(K) R29.1
$1N6613: R11.1 R21.1
$3N419: ANT_发射.1 L7.1 U3.2
$3N1454: U5.1(S1) X1.3
$3N1471: U5.6(G1) X1.1
$3N1686: C8.2 X1.2(GND)
$3N1701: C9.1 X1.4(GND)
$3N2015: R4.2 R5.1 U5.4(G2)
$4N795: U15.8(VDD) X4.1
$4N1010: R7.2 U15.6(OUT1)
$4N1026: R14.1 U15.5(PAD1)
$4N1184: U15.4(PAD0) U16.2
$5N677: DC1.1 SW2.1
Net-(ANT_接收-1): ANT_接收.1 C11.1 L3.2 U8.2
Net-(C21-1): C21.1 L2.2 U5.3(S2)
Net-(C21-2): C21.2 L1.2
Net-(L1-1): L1.1 L7.2 U4.2
Net-(L4-2): L4.2 U8.1 U15.2(C1)

Not connected (* = marked no-connect by the designer): L6 4(NC) 5(IO0) 6(IO1) 7(IO2) 8(IO3) 9(IO4) 10(IO5) 11(IO6) 12(IO7) 13(IO8) 14(IO10) 16(NC) 17(SPIHD) 18(SPIWP) 19(SPICS0) 20(SPICLK) 21(SPIQ) 22(SPID) 23(NC) 24(NC) 26(NC) 27(NC) 28(NC) 29(NC) 30(IO18) 31(IO19) 32(NC) 33(NC) 36(NC) 37(NC); SW1 1 3; SW2 3; SW4 1 3; U1 2(PC13-TAMPER-RTC) 3(PC14-OSC32_IN) 4(PC15-OSC32_OUT) 10(PA0-WKUP) 14(PA4) 15(PA5) 16(PA6) 17(PA7) 21(PB10) 25(PB12) 26(PB13) 27(PB14) 28(PB15) 29(PA8) 30(PA9) 31(PA10) 32(PA11) 33(PA12) 38(PA15) 40(PB4) 41(PB5) 45(PB8) 46(PB9); U7 2(VOUT); U15 7(OUT0)

## Notes on the sheets
sheet 1
- 主芯片
- 电源滤波
- BOOT
- 串口
- 晶振
- STLink
- 复位

# Board PCB1
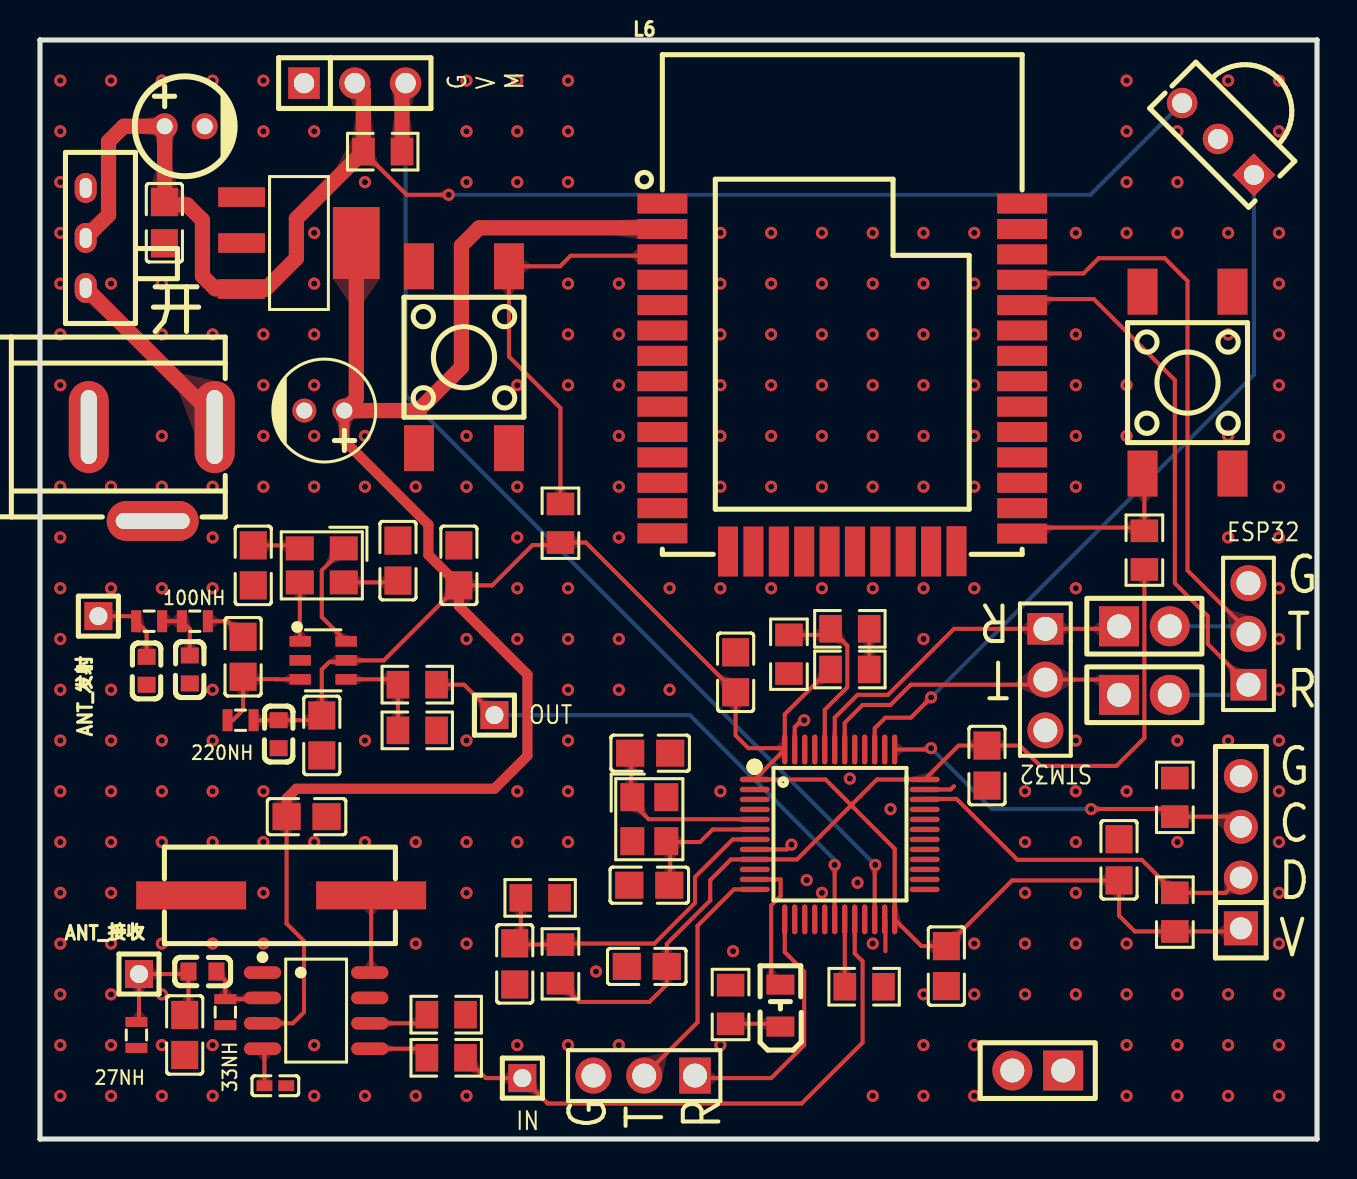
[diagram p5: board, top side]
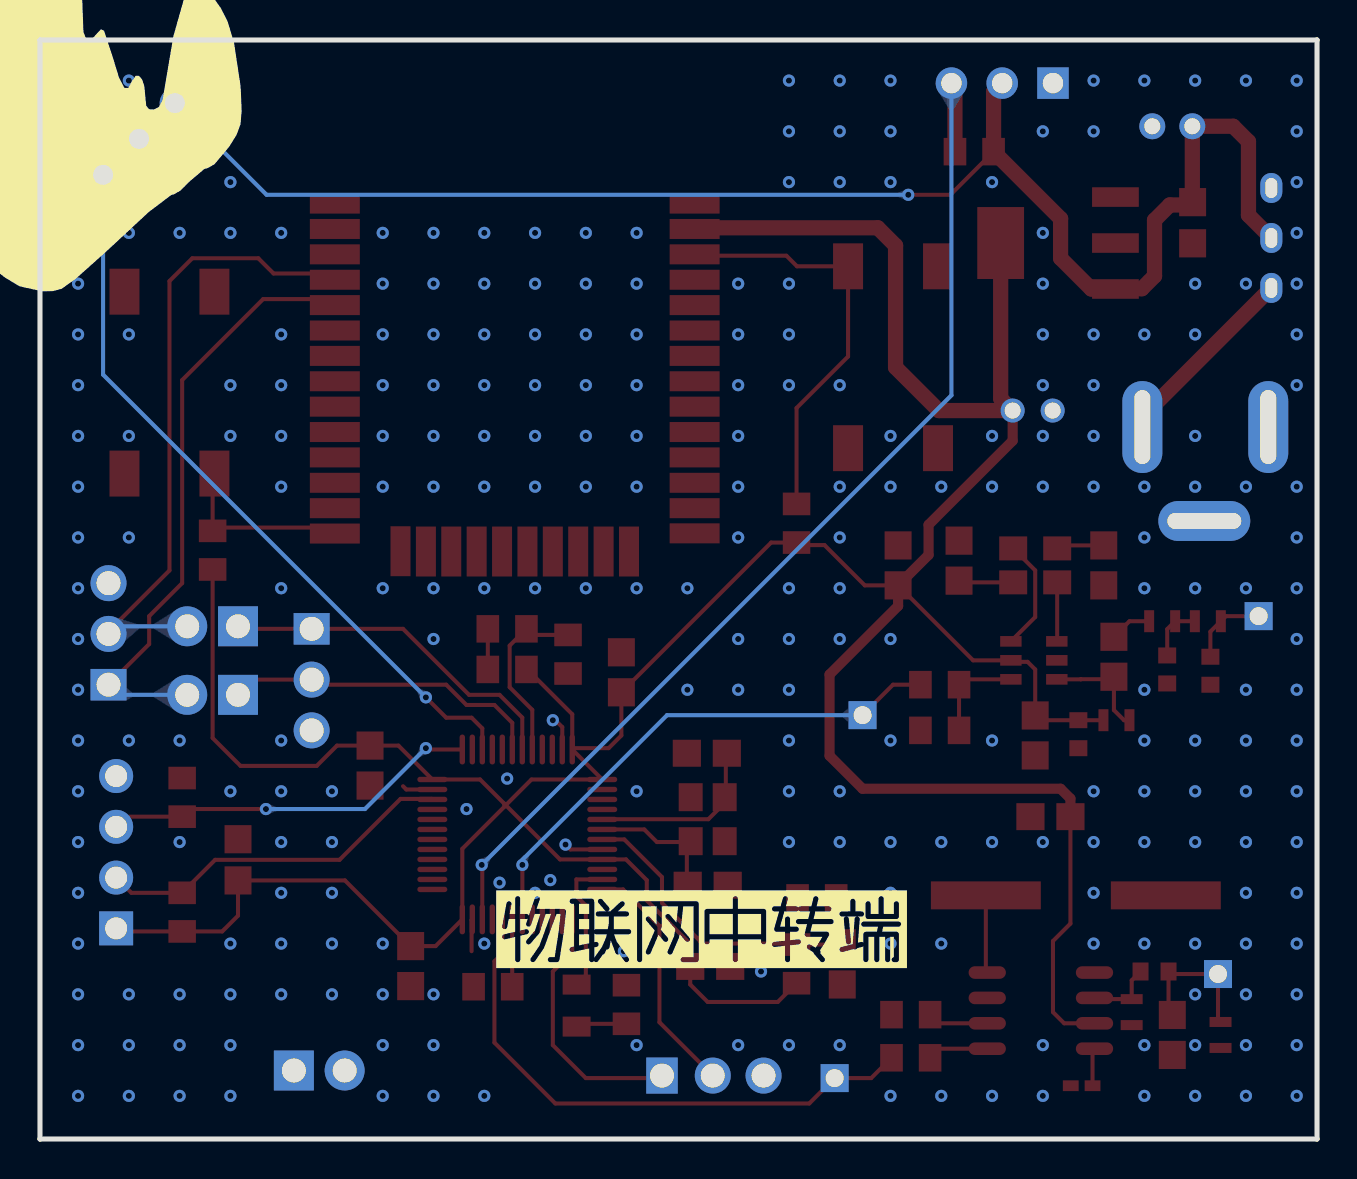
[diagram p6: board, bottom side, seen from below]

Outline 63.88 x 54.99 mm; copper layers: Top Layer, Bottom Layer. Coordinates in mm from the lower left corner of the outline.
Outline path: 0,54.99 0,0 arc(0,0) 0,0 63.88,0 arc(63.88,0) 63.88,0 63.88,54.99 arc(63.88,54.99) 63.88,54.99 0,54.99 arc(0,54.99) 0,54.99
Stack: Top Layer 0.035mm / Dielectric1 1.51mm FR4 er 4.5 / Bottom Layer 0.035mm

## Design rules (mm)
spacing safeClearance (default): track to track 0.152, other pairs 0.152 to 0.3
track width trackWidth (default): min 0.127, default 0.254, max 2.54
differential pair differentialPair (default): width min 0.127, default 0.254, max 2.54; gap min 0.152, default 0.152
via viaSize (default): diameter min 0.5, default 0.61, max 10; hole min 0.3, default 0.305, max 6

## Placement (name value [footprint] x y rotation side)
27NH  27nH  [IND-SMD_L1.7-W1.0-SCW1608C39NJST]  4.83 5.21 90 top
33NH  33nH  [IND-SMD_L1.7-W1.0-SCW1608C39NJST]  9.27 6.35 90 top
100NH  22nH  [IND-SMD_L1.7-W1.0-SCW1608C39NJST]  7.75 25.91 0 top
220NH  22nH  [IND-SMD_L1.7-W1.0-SCW1608C39NJST]  10.03 20.95 180 top
ANT_发射  -  [HDR-TH_1P-V-M_XKB_X4611WV-01I-C28D40]  2.92 26.16 0 top
ANT_接收  -  [HDR-TH_1P-V-M_XKB_X4611WV-01I-C28D40]  4.95 8.26 90 top
C1  100nF  [C0805#2]  45.34 8.65 270 top
C2  100nF  [C0805#2]  47.37 18.69 270 top
C3  100nF  [C0805#2]  30.35 8.64 180 top
C4  100nF  [C0805#2]  34.8 23.35 90 top
C5  22pF  [C0805#2]  30.48 12.7 0 top
C6  22pF  [C0805#2]  30.52 19.3 180 top
C7  100n  [C0805#2]  14.1 20.19 90 top
C8  1.5p  [C0805#2]  10.67 28.7 90 top
C9  1.5p  [C0805#2]  17.91 28.94 90 top
C10  100n  [C0805#2]  20.95 28.7 90 top
C11  4.7p  [C0805#2]  7.24 5.21 270 top
C12  22uF  [CAP-TH_BD5.0-P2.00-D0.6-FD]  14.22 36.45 180 top
C13  100nF  [C0805]  6.22 45.85 270 top
C14  10uF  [CAP-TH_BD5.0-P2.00-D0.8-FD]  7.24 50.67 0 top
C15  1u  [C0805#2]  13.33 16.13 0 top
C19  100nF  [C0805]  23.75 8.76 270 top
C20  100nF  [C0805]  53.98 13.97 90 top
C21  1.5p  [C0805#2]  10.16 24.13 90 top
DC1  12V  [DC-IN-TH_DC005-T20]  5.59 33.27 0 top
H1  STLink  [HDR-TH_4P-P2.54-V-M]  60.07 14.35 90 top
H2  stm32串口1  [HDR-TH_3P-P2.54-V-M-1]  50.29 22.99 270 top
H3  esp32串口  [HDR-TH_3P-P2.54-V-M-1]  60.45 25.27 90 top
H4  stm32串口2  [HDR-TH_3P-P2.54-V-M-1]  30.23 3.18 180 top
H5  -  [HDR-TH_2P-P2.54-V-F]  55.24 25.65 0 top
H6  -  [HDR-TH_2P-P2.54-V-F]  55.24 22.23 0 top
H7  舵机  [HDR-TH_3P-P2.54-V-F]  15.75 52.83 0 top
H8  GND  [HDR-TH_2P-P2.54-V-F]  49.91 3.43 180 top
H9  -  [HDR-TH_1P-V-M_XKB_X4611WV-01I-C28D40]  24.13 3.05 0 top
H10  -  [HDR-TH_1P-V-M_XKB_X4611WV-01I-C28D40]  22.73 21.21 270 top
L6  ESP32-C3S-2M  [WIFIM-SMD_ESP32-C3S-2M]  40.13 38.1 0 top
L7  22nH  [IND-SMD_L1.7-W1.0-SCW1608C39NJST]  5.46 25.91 0 top
LED5  -  [LED0805-R-RD]  37.04 6.68 90 top
R2  10k  [R0805]  26.04 30.81 270 top
R3  10k  [R0805]  55.24 29.46 270 top
R4  100k  [R0805]  18.87 20.45 180 top
R5  10k  [R0805]  18.87 22.73 0 top
R6  10k  [R0805]  17.14 49.4 0 top
R7  10k  [R0805]  20.32 6.22 180 top
R8  10k  [R0805]  26.04 8.76 270 top
R9  10k  [R0805]  37.46 24.26 90 top
R10  10k  [R0805]  41.23 7.62 180 top
R11  100R  [R0805]  40.51 25.53 180 top
R12  10k  [R0805]  56.77 11.35 270 top
R13  10k  [R0805]  56.77 17.09 90 top
R14  10k  [R0805]  20.32 4.06 0 top
R18  10k  [R0805]  25.02 12.06 0 top
R21  10k  [R0805]  40.51 23.5 180 top
R29  1K  [R0805]  34.54 6.73 90 top
SW1  MPU6050  [SW-SMD_4P-L6.0-W6.0-P4.50-LS9.0-2]  57.4 37.85 270 top
SW2  电源  [SW-TH_MK-12D18-G040]  2.29 45.09 90 top
SW4  MPU6050  [SW-SMD_4P-L6.0-W6.0-P4.50-LS9.0-2]  21.21 39.12 90 top
U1  STM32F103C8T6  [LQFP-48_L7.0-W7.0-P0.50-LS9.0-BL]  40.01 15.24 270 top
U3  9p  [C0603]  5.33 23.43 90 top
U4  9p  [C0603]  7.49 23.5 90 top
U5  XL4456  [SOT-23-6_L2.9-W1.6-P0.95-LS2.9-BL]  14.16 23.95 270 top
U6  100p  [C0603]  11.94 20.26 270 top
U7  AMS1117-3V3  [SOT-223-3_L6.7-W3.7-P2.30-LS7.0-BR]  12.95 44.83 180 top
U8  2.2p  [C0603]  8.13 8.38 180 top
U14  VS1838  [OPTO-TH_3P-L7.0-W5.6-P2.54-L]  58.93 50.04 135 top
U15  XL700  [SOP-8_L4.9-W3.9-P1.27-LS6.0-BL]  13.81 6.43 270 top
U16  0.47u  [C0402]  11.77 2.67 180 top
X1  NX3225SA-26MHz-STD-CSR-6  [CRYSTAL-SMD_4P-L3.2-W2.5-BL]  14.1 28.7 180 top
X3  NX3225SA-26MHz-STD-CSR-6  [CRYSTAL-SMD_4P-L3.2-W2.5-BL]  30.48 16 270 top
X4  -  [OSC-SMD_2P-L11.4-W4.7-LS12.3]  12.07 12.19 180 top

## Footprints (pads in the part's own frame, mm; a bottom-side part is the same pattern mirrored in y, then rotated)
C0402
  rect 0.79x0.54 smd: 1(-0.545,0) 2(0.545,0)
C0603
  rect 0.8x0.9 smd: 1(-0.7,0) 2(0.7,0)
C0805
  rect 1.41x1.35 smd: 1(-1.03,0) 2(1.03,0)
C0805#2
  rect 1.41x1.35 smd: 1(-1,0) 2(1,0)
CAP-TH_BD5.0-P2.00-D0.6-FD
  round 1.202 hole 0.8: 1(-1.001,0) 2(1.001,0)
CAP-TH_BD5.0-P2.00-D0.8-FD
  round 1.3 hole 0.8: 1(-1.001,0) 2(1.001,0)
CRYSTAL-SMD_4P-L3.2-W2.5-BL
  rect 1.4x1.2 smd: 1(-1.1,-0.85) 2(1.1,-0.85) 3(1.1,0.85) 4(-1.1,0.85)
DC-IN-TH_DC005-T20
  oval 1.999x4.6 hole 0.8x3.701: 1(3.15,2.349) 2(-3.15,2.349)
  oval 4.6x1.999 hole 3.701x0.8: 3(0.051,-2.349)
HDR-TH_1P-V-M_XKB_X4611WV-01I-C28D40
  rect 1.399x1.399 hole 0.899: 1(0,0)
HDR-TH_2P-P2.54-V-F
  rect 1.999x1.999 hole 1.199: 1(-1.27,0)
  round 1.999 hole 1.199: 2(1.27,0)
HDR-TH_3P-P2.54-V-F
  rect 1.575x1.575 hole 1.02: 1(-2.54,0)
  round 1.575 hole 1.02: 2(0,0) 3(2.54,0)
HDR-TH_3P-P2.54-V-M-1
  rect 1.575x1.801 hole 1.199: 1(-2.54,0)
  round 1.801 hole 1.199: 2(0,0) 3(2.54,0)
HDR-TH_4P-P2.54-V-M
  rect 1.7x1.7 hole 1.1: 1(-3.81,0)
  round 1.7 hole 1.1: 2(-1.27,0) 3(1.27,0) 4(3.81,0)
IND-SMD_L1.7-W1.0-SCW1608C39NJST
  rect 0.5x1.1 smd: 1(-0.65,0) 2(0.65,0)
LED0805-R-RD
  rect 1x1.399 smd: 1(1.05,0) 2(-1.05,0)
LQFP-48_L7.0-W7.0-P0.50-LS9.0-BL
  oval 0.27x1.5 smd: 1(-2.75,-4.25) 2(-2.25,-4.25) 3(-1.75,-4.25) 4(-1.25,-4.25) 5(-0.75,-4.25) 6(-0.25,-4.25) 7(0.25,-4.25) 8(0.75,-4.25) 9(1.25,-4.25) 10(1.75,-4.25) 11(2.25,-4.25) 12(2.75,-4.25) 25(2.75,4.25) 26(2.25,4.25) 27(1.75,4.25) 28(1.25,4.25) 29(0.75,4.25) 30(0.25,4.25) 31(-0.25,4.25) 32(-0.75,4.25) 33(-1.25,4.25) 34(-1.75,4.25) 35(-2.25,4.25) 36(-2.75,4.25)
  oval 1.5x0.27 smd: 13(4.25,-2.75) 14(4.25,-2.25) 15(4.25,-1.75) 16(4.25,-1.25) 17(4.25,-0.75) 18(4.25,-0.25) 19(4.25,0.25) 20(4.25,0.75) 21(4.25,1.25) 22(4.25,1.75) 23(4.25,2.25) 24(4.25,2.75) 37(-4.25,2.75) 38(-4.25,2.25) 39(-4.25,1.75) 40(-4.25,1.25) 41(-4.25,0.75) 42(-4.25,0.25) 43(-4.25,-0.25) 44(-4.25,-0.75) 45(-4.25,-1.25) 46(-4.25,-1.75) 47(-4.25,-2.25) 48(-4.25,-2.75)
OPTO-TH_3P-L7.0-W5.6-P2.54-L
  rect 1.524x1.524 hole 1.001: 1(-2.54,0)
  round 1.524 hole 1.001: 2(0,0) 3(2.54,0)
OSC-SMD_2P-L11.4-W4.7-LS12.3
  rect 5.499x1.399 smd: 1(-4.501,0) 2(4.501,0)
R0805
  rect 1.133x1.377 smd: 1(-0.966,0) 2(0.966,0)
SOP-8_L4.9-W3.9-P1.27-LS6.0-BL
  oval 0.63x1.865 smd: 1(-1.905,-2.683) 2(-0.635,-2.683) 3(0.635,-2.683) 4(1.905,-2.683) 5(1.905,2.683) 6(0.635,2.683) 7(-0.635,2.683) 8(-1.905,2.683)
SOT-23-6_L2.9-W1.6-P0.95-LS2.9-BL
  rect 0.532x1.072 smd: 1(-0.95,-1.149) 2(0,-1.149) 3(0.95,-1.149) 4(0.95,1.149) 5(0,1.149) 6(-0.95,1.149)
SOT-223-3_L6.7-W3.7-P2.30-LS7.0-BR
  rect 2.34x0.98 smd: 1(2.87,-2.3) 2(2.87,0) 3(2.87,2.3)
  rect 2.34x3.6 smd: 4(-2.87,0)
SW-SMD_4P-L6.0-W6.0-P4.50-LS9.0-2
  rect 2.3x1.5 smd: 1(-4.55,2.25) 2(4.55,2.25) 3(-4.55,-2.25) 4(4.55,-2.25)
SW-TH_MK-12D18-G040
  oval 1.5x1.1 hole 1x0.6: 1(-2.5,0) 2(0,0) 3(2.5,0)
WIFIM-SMD_ESP32-C3S-2M
  rect 2.499x1.001 smd: 1(-8.999,8.704) 2(-8.999,7.434) 3(-8.999,6.165) 4(-8.999,4.894) 5(-8.999,3.624) 6(-8.999,2.354) 7(-8.999,1.085) 8(-8.999,-0.185) 9(-8.999,-1.456) 10(-8.999,-2.725) 11(-8.999,-3.995) 12(-8.999,-5.266) 13(-8.999,-6.535) 14(-8.999,-7.795) 25(8.999,-7.806) 26(8.999,-6.535) 27(8.999,-5.266) 28(8.999,-3.995) 29(8.999,-2.725) 30(8.999,-1.456) 31(8.999,-0.185) 32(8.999,1.085) 33(8.999,2.354) 34(8.999,3.624) 35(8.999,4.894) 36(8.999,6.165) 37(8.999,7.434) 38(8.999,8.704)
  rect 1.001x2.499 smd: 15(-5.715,-8.704) 16(-4.445,-8.704) 17(-3.175,-8.704) 18(-1.905,-8.704) 19(-0.635,-8.704) 20(0.635,-8.704) 21(1.905,-8.704) 22(3.175,-8.704) 23(4.445,-8.704) 24(5.715,-8.69)

## Nets
As in the schematic, except:
3V3: 220NH.1 C1.1 C2.1 C3.1 C4.1 C7.2 C10.1 C12.1 C15.1 C20.1 H1.1 L6.2 R2.2 R3.2 R8.2 R12.2 R21.2 U1.1 U1.9 U1.24 U1.36 U1.48 U5.5 U6.1 U7.4 U15.3
GND: 27NH.1 33NH.1 C1.2 C2.2 C3.2 C4.2 C5.1 C6.1 C7.1 C8.1 C9.2 C10.2 C11.2 C12.2 C13.2 C14.2 C15.2 C19.2 C20.2 DC1.2 DC1.3 H1.4 H2.3 H3.3 H4.3 H7.1 H8.1 H8.2 L6.1 L6.15 L6.38 R4.1 R7.1 R9.1 R10.1 R13.2 R18.2 R29.2 SW1.2 SW4.2 U1.8 U1.23 U1.35 U1.47 U3.1 U4.1 U5.2 U6.2 U7.1 U14.2 U15.1 U16.1 X3.2 X3.4 X4.2
$3N423: 100NH.1 L7.2 U4.2
$3N684: 100NH.2 C21.2
$3N827: 220NH.2 C21.1 U5.3
$4N217: 27NH.2 ANT_接收.1 C11.1 U8.2
$4N394: 33NH.2 U8.1 U15.2

Pads without a net: L6 4 5 6 7 8 9 10 11 12 13 14 16 17 18 19 20 21 22 23 24 26 27 28 29 30 31 32 33 36 37; SW1 1 3; SW2 3; SW4 1 3; U1 2 3 4 10 14 15 16 17 21 25 26 27 28 29 30 31 32 33 38 40 41 45 46; U7 2; U15 7

## Via types
v1: diameter 0.61, hole 0.305, Top Layer to Bottom Layer, 268 vias

## Routing (per net, layer and track width the routed paths; a pad name or vN(x,y) marks a point on that pad's centre or on a via; arc(x,y) is an arc through that point)
3V3: length 203.1
  Top Layer w0.203: 220NH.1 13.86,20.95 C7.2 14.1,23.5 14.48,23.88 15.24,23.88 U5.5 17.2,23.95 C10.1 22.62,27.7 24.64,29.72 25.91,29.72 R2.2 27.3,29.84 C4.1 34.8,20.19 35.43,19.56 37.19,19.56 U1.48 ; C15.1 12.33,10.78 13.21,9.91 13.21,6.35 12.65,5.79 U15.3 ; 40.66,16.78 40.66,16.62 42.76,14.52 U1.24 44.09,9.65 C1.1 48.63,12.94 C20.1 53.98,11.18 54.76,10.39 59.92,10.39 60.07,10.54 ; 40.66,16.78 40.58,16.7 ; 40.66,16.78 41.87,17.99 U1.36 45.95,19.69 C2.1 49.02,19.69 50.04,18.67 53.85,18.67 55.24,20.07 R3.2 ; R21.2 39.5,23.5 37.26,21.25 U1.48 ; 40.58,16.7 37.87,13.99 U1.9 34.56,13.99 33.53,12.95 33.53,11.94 31.35,9.76 C3.1 31.35,7.73 30.48,6.86 26.97,6.86 R8.2 ; 40.58,16.7 39.29,17.99 U1.1 U1.48
  Top Layer w0.508: C12.1 15.23,34.94 19.43,30.73 19.43,29.23 C10.1 20.95,26.67 24.38,23.24 24.38,19.18 22.73,17.53 12.83,17.53 12.33,17.03 C15.1
  Top Layer w0.762: U7.4 15.82,37.05 C12.1 18.92,36.45 21.08,38.61 21.08,44.7 21.97,45.59 31.07,45.59 L6.2
GND: length 6.7
  Top Layer w0.203: U1.8 37.35,14.49 v1(37.59,14.73) ; U1.47 37.76,20.61 38.1,20.95 ; 45.72,17.65 45.56,17.49 U1.35 ; U1.23 42.29,10.95 42.29,9.4
  vias: v1(1.02,52.96) v1(1.02,50.42) v1(1.02,47.88) v1(1.02,45.34) v1(1.02,42.8) v1(1.02,40.26) v1(1.02,37.72) v1(1.02,32.64) v1(1.02,30.1) v1(1.02,27.56) v1(1.02,25.02) v1(1.02,22.48) v1(1.02,19.94) v1(1.02,17.4) v1(1.02,14.86) v1(1.02,12.32) v1(1.02,9.78) v1(1.02,7.24) v1(1.02,4.7) v1(1.02,2.16) v1(3.56,52.96) v1(3.56,42.8) v1(3.56,32.64) v1(3.56,27.56) v1(3.56,22.48) v1(3.56,19.94) v1(3.56,17.4) v1(3.56,14.86) v1(3.56,12.32) v1(3.56,9.78) v1(3.56,7.24) v1(3.56,4.7) v1(3.56,2.16) v1(6.1,52.96) v1(6.1,42.8) v1(6.1,40.26) v1(6.1,35.18) v1(6.1,32.64) v1(6.1,27.56) v1(6.1,19.94) v1(6.1,17.4) v1(6.1,14.86) v1(6.1,9.78) v1(6.1,7.24) v1(6.1,4.7) v1(6.1,2.16) v1(8.64,52.96) v1(8.64,40.26) v1(8.64,32.64) v1(8.64,30.1) v1(8.64,27.56) v1(8.64,22.48) v1(8.64,19.94) v1(8.64,17.4) v1(8.64,14.86) v1(8.64,9.78) v1(8.64,4.7) v1(8.64,2.16) v1(11.18,52.96) v1(11.18,50.42) v1(11.18,40.26) v1(11.18,37.72) v1(11.18,35.18) v1(11.18,32.64) v1(11.18,17.4) v1(11.18,14.86) v1(11.18,12.32) v1(11.18,9.78) v1(13.72,50.42) v1(13.72,45.34) v1(13.72,42.8) v1(13.72,40.26) v1(13.72,37.72) v1(13.72,35.18) v1(13.72,32.64) v1(13.72,14.86) v1(13.72,4.7) v1(13.72,2.16) v1(16.26,47.88) v1(16.26,35.18) v1(16.26,32.64) v1(16.26,19.94) v1(16.26,14.86) v1(16.26,2.16) v1(18.8,32.64) v1(18.8,14.86) v1(18.8,9.78) v1(18.8,2.16) v1(21.34,52.96) v1(21.34,50.42) v1(21.34,47.88) v1(21.34,35.18) v1(21.34,32.64) v1(21.34,25.02) v1(21.34,19.94) v1(21.34,14.86) v1(21.34,12.32) v1(21.34,9.78) v1(21.34,2.16) v1(23.88,52.96) v1(23.88,50.42) v1(23.88,47.88) v1(23.88,37.72) v1(23.88,32.64) v1(23.88,30.1) v1(23.88,27.56) v1(23.88,25.02) v1(23.88,17.4) v1(23.88,14.86) v1(23.88,4.7) v1(26.42,52.96) v1(26.42,50.42) v1(26.42,47.88) v1(26.42,42.8) v1(26.42,40.26) v1(26.42,37.72) v1(26.42,27.56) v1(26.42,25.02) v1(26.42,22.48) v1(26.42,19.94) v1(26.42,17.4) v1(26.42,14.86) v1(26.42,4.7) v1(27.81,8.38) v1(28.96,42.8) v1(28.96,40.26) v1(28.96,37.72) v1(28.96,35.18) v1(28.96,32.64) v1(28.96,30.1) v1(28.96,25.02) v1(28.96,22.48) v1(28.96,4.7) v1(31.5,27.56) v1(31.5,22.48) v1(34.04,45.34) v1(34.04,42.8) v1(34.04,40.26) v1(34.04,37.72) v1(34.04,35.18) v1(34.04,32.64) v1(34.04,27.56) v1(34.04,17.4) v1(34.04,4.7) v1(34.67,9.4) v1(36.58,45.34) v1(36.58,42.8) v1(36.58,40.26) v1(36.58,37.72) v1(36.58,35.18) v1(36.58,32.64) v1(36.58,27.56) v1(38.23,20.95) v1(38.35,12.95) v1(39.12,45.34) v1(39.12,42.8) v1(39.12,40.26) v1(39.12,37.72) v1(39.12,35.18) v1(39.12,32.64) v1(39.12,27.56) v1(39.12,12.32) v1(40.51,18.03) v1(40.89,12.83) v1(41.66,45.34) v1(41.66,42.8) v1(41.66,40.26) v1(41.66,37.72) v1(41.66,35.18) v1(41.66,32.64) v1(41.66,27.56) v1(41.66,9.78) v1(41.66,2.16) v1(42.55,16.51) v1(44.2,45.34) v1(44.2,42.8) v1(44.2,40.26) v1(44.2,37.72) v1(44.2,35.18) v1(44.2,32.64) v1(44.2,27.56) v1(44.2,25.02) v1(44.2,7.24) v1(44.2,4.7) v1(44.2,2.16) v1(46.74,45.34) v1(46.74,42.8) v1(46.74,40.26) v1(46.74,37.72) v1(46.74,35.18) v1(46.74,32.64) v1(46.74,27.56) v1(46.74,9.78) v1(46.74,7.24) v1(46.74,4.7) v1(46.74,2.16) v1(49.28,17.4) v1(49.28,14.86) v1(49.28,12.32) v1(49.28,9.78) v1(49.28,7.24) v1(51.82,45.34) v1(51.82,40.26) v1(51.82,37.72) v1(51.82,35.18) v1(51.82,32.64) v1(51.82,27.56) v1(51.82,19.94) v1(51.82,17.4) v1(51.82,14.86) v1(51.82,12.32) v1(51.82,9.78) v1(51.82,7.24) v1(54.36,52.96) v1(54.36,50.42) v1(54.36,47.88) v1(54.36,45.34) v1(54.36,37.72) v1(54.36,35.18) v1(54.36,17.4) v1(54.36,9.78) v1(54.36,7.24) v1(54.36,4.7) v1(54.36,2.16) v1(56.9,50.42) v1(56.9,47.88) v1(56.9,45.34) v1(56.9,19.94) v1(56.9,14.86) v1(56.9,7.24) v1(56.9,4.7) v1(56.9,2.16) v1(59.44,52.96) v1(59.44,45.34) v1(59.44,40.26) v1(59.44,35.18) v1(59.44,30.1) v1(59.44,19.94) v1(59.44,7.24) v1(59.44,4.7) v1(59.44,2.16) v1(61.98,52.96) v1(61.98,50.42) v1(61.98,45.34) v1(61.98,42.8) v1(61.98,40.26) v1(61.98,37.72) v1(61.98,35.18) v1(61.98,32.64) v1(61.98,30.1) v1(61.98,27.56) v1(61.98,25.02) v1(61.98,22.48) v1(61.98,19.94) v1(61.98,17.4) v1(61.98,14.86) v1(61.98,12.32) v1(61.98,9.78) v1(61.98,7.24) v1(61.98,4.7) v1(61.98,2.16)
VCC: length 76.9
  Top Layer w0.203: v1(20.45,47.24) 18.34,47.24 R6.1
  Top Layer w0.762: H7.2 16.18,52.4 R6.1 12.83,46.05 12.83,44.07 11.29,42.53 U7.3 10.07,42.55 8.76,42.55 8.13,43.18 8.13,45.97 7.37,46.74 6.48,46.74 6.24,46.98 C14.1 4.19,50.67 3.43,49.91 3.43,46.23 SW2.2
  Bottom Layer w0.203: U14.3 52.54,47.24 v1(20.45,47.24)
433_IN: length 28.4
  Top Layer w0.203: R14.2 22.3,3.05 H9.1 25.4,1.78 38.1,1.78 41.15,4.83 41.15,8.89 40.76,9.28 U1.20
433_OUT: length 26.5
  Top Layer w0.203: U1.18 39.75,10.99 v1(39.75,13.72) ; H10.1 21.21,22.73 19.84,22.73
  Bottom Layer w0.203: H10.1 32.51,21.21 39.75,13.97 v1(39.75,13.72)
BOOT0: length 9.1
  Top Layer w0.203: U1.44 39.26,21.48 40.39,22.61 40.39,24.69 R11.2 39.24,25.22 R9.2
BOOT1: length 3.4
  Top Layer w0.203: R10.2 40.26,10.99 U1.19
EN: length 20.9
  Top Layer w0.203: R2.1 26.04,36.58 23.46,39.15 SW4.4 26.01,43.67 26.54,44.2 31.06,44.2 L6.3
ESP32_RXD: length 30.2
  Top Layer w0.203: H3.1 58.42,24.77 58.42,26.16 56.77,27.81 56.77,37.97 52.72,42.03 49.13,42.03
  Bottom Layer w0.203: H6.2 59.94,22.23 H3.1
ESP32_TXD: length 32.1
  Top Layer w0.203: H3.2 60.45,25.4 57.4,28.45 57.4,42.93 56.26,44.07 52.96,44.07 52.2,43.31 49.14,43.31 49.13,43.3
  Bottom Layer w0.203: H5.2 60.07,25.65 H3.2
IO9: length 9.1
  Top Layer w0.203: 49.13,30.59 55.08,30.59 R3.1 55.24,33.2 SW1.4
IR: length 37.4
  Top Layer w0.203: v1(44.58,22.1) 43.56,21.08 42.29,21.08 41.76,20.55 U1.39
  Bottom Layer w0.203: U14.1 60.72,38.25 v1(44.58,22.1)
LED_EN: length 6.9
  Top Layer w0.203: U1.11 37.05,12.99 37.05,12.16 36.58,11.68 36.58,8.19 LED5.1
MOTOR: length 55.1
  Top Layer w0.203: v1(41.78,13.72) 41.76,13.69 U1.22
  Top Layer w0.762: R6.2 18.11,52.66 H7.3
  Bottom Layer w0.203: v1(41.78,13.72) 18.29,37.21 H7.3
NRST: length 17.4
  Top Layer w0.203: 24.05,12.06 24.05,10.1 C19.1 23.81,9.73 R8.1 26.08,9.78 30.73,9.78 32.77,11.81 32.77,13.11 34.65,14.99 U1.7
OSC_IN: length 9
  Top Layer w0.203: U1.5 35.74,16 30.45,16 29.57,16.87 29.57,19.25 C6.2
OSC_OUT: length 7
  Top Layer w0.203: U1.6 33.65,15.49 33.02,14.86 31.37,14.86 X3.3 ; 31.52,12.45 31.52,14.42 31.27,14.67
RDX: length 12.9
  Top Layer w0.203: U1.13 37.26,9.35 38.23,8.38 38.23,4.7 36.58,3.05 32.89,3.05 H4.1
STM32_RDX: length 17.7
  Top Layer w0.203: H5.1 53.85,25.53 45.72,25.53 42.42,22.23 40.89,22.23 39.76,21.09 U1.43
STM32_TDX: length 16.3
  Top Layer w0.203: U1.42 40.26,20.82 41.15,21.72 42.55,21.72 43.56,22.73 50.04,22.73 H2.2 53.21,22.99 H6.1
SWCLK: length 19.9
  Top Layer w0.203: 60.07,15.62 60.45,16 60.45,16.13 R13.1 56.39,16.51 52.45,16.51 ; U1.37 44.51,19.49 v1(44.58,19.56)
  Bottom Layer w0.203: v1(52.58,16.51) 47.62,16.51 v1(44.58,19.56)
SWDIO: length 18.1
  Top Layer w0.203: H1.2 59.31,12.32 R12.1 55.12,13.97 48.89,13.97 45.85,17.02 44.28,17.02 U1.34
TDX: length 12.2
  Top Layer w0.203: U1.12 34.71,12.49 32.89,10.67 32.89,5.84 H4.2
$1N6598: length 2.6
  Top Layer w0.203: LED5.2 36.9,5.77 34.54,5.77
$1N6613: length 2
  Top Layer w0.203: R11.1 R21.1
$3N419: length 4
  Top Layer w0.203: U3.2 5.33,25.39 L7.1 4.56,26.16 ANT_发射.1
$3N423: length 2.9
  Top Layer w0.203: L7.2 100NH.1 7.49,25.51 U4.2
$3N684: length 2.1
  Top Layer w0.203: 100NH.2 9.38,25.91 C21.2
$3N827: length 5.6
  Top Layer w0.203: 220NH.2 9.65,20.95 10.16,21.46 C21.1 10.28,23.01 11.81,23.01 11.82,23 U5.3
$3N1454: length 3
  Top Layer w0.203: X1.3 13,24.92 U5.1
$3N1471: length 5.6
  Top Layer w0.203: X1.1 14.1,28.45 14.1,26.12 U5.6
$3N1686: length 2.4
  Top Layer w0.203: C8.2 12.85,29.7 X1.2
$3N1701: length 2.7
  Top Layer w0.203: X1.4 17.82,27.85 C9.1
$3N2015: length 5
  Top Layer w0.203: R4.2 R5.1 17.64,23 U5.4
$4N217: length 7.2
  Top Layer w0.203: 27NH.2 4.95,5.98 ANT_接收.1 7.3,8.26 U8.2 7.43,6.4 C11.1
$4N394: length 3.5
  Top Layer w0.203: U15.2 11.07,7 33NH.2 9.27,7.94 U8.1
$4N795: length 3.9
  Top Layer w0.203: X4.1 16.57,8.4 U15.8
$4N1010: length 3
  Top Layer w0.203: R7.2 18.92,5.79 U15.6
$4N1026: length 3
  Top Layer w0.203: U15.5 18.9,4.52 R14.1
$4N1184: length 1.9
  Top Layer w0.203: U15.4 11.23,4.42 U16.2
$5N677: length 9.6
  Top Layer w0.762: DC1.1 8.74,36.13 SW2.1

## Copper pours and planes (outline as drawn; the poured copper is in the pictures)
3V3 on Top Layer: 41.51,16.8 41.48,16.98 41.41,17.15 41.31,17.3 41.18,17.43 41.02,17.53 40.85,17.6 40.67,17.64 40.49,17.64 40.31,17.6 40.14,17.53 39.98,17.43 39.85,17.3 39.75,17.15 39.68,16.98 39.64,16.8 39.64,16.61 39.68,16.43 39.75,16.26 39.85,16.11 39.98,15.98 40.14,15.87 40.31,15.8 40.49,15.77 40.67,15.77 40.85,15.8 41.02,15.87 41.18,15.98 41.31,16.11 41.41,16.26 41.48,16.43 41.51,16.61
GND on Top Layer: -4.06,60.33 68.83,60.33 68.83,-2.92 -4.06,-2.92
GND on Bottom Layer: -3.05,59.44 65.91,59.44 65.91,-2.16 -3.05,-2.16

Small or netless copper shapes (teardrops, artwork), in the pictures only: 183 on Top Layer, 14 on Bottom Layer

## Text on the board
Bottom Silkscreen Layer: 物联网中转端
Top Silkscreen Layer: IN | OUT | ESP32 | G / V / M | STM32 | G / C / D / V | G / T / R | T / R | 开
